# EasyEDA Pro project 2024-SS-ZT-2(最后一练).eprj

# Schematic SCH

## Sheets
1 P1: Create Date: 2024-05-28; Page Name: P1; Project Name: 2024-SS-ZT-2(最后一练); Schematic Name: SCH; Update Date: 2024-05-28; Company: 嘉立创EDA; Page Size: A4; Version: V1.0
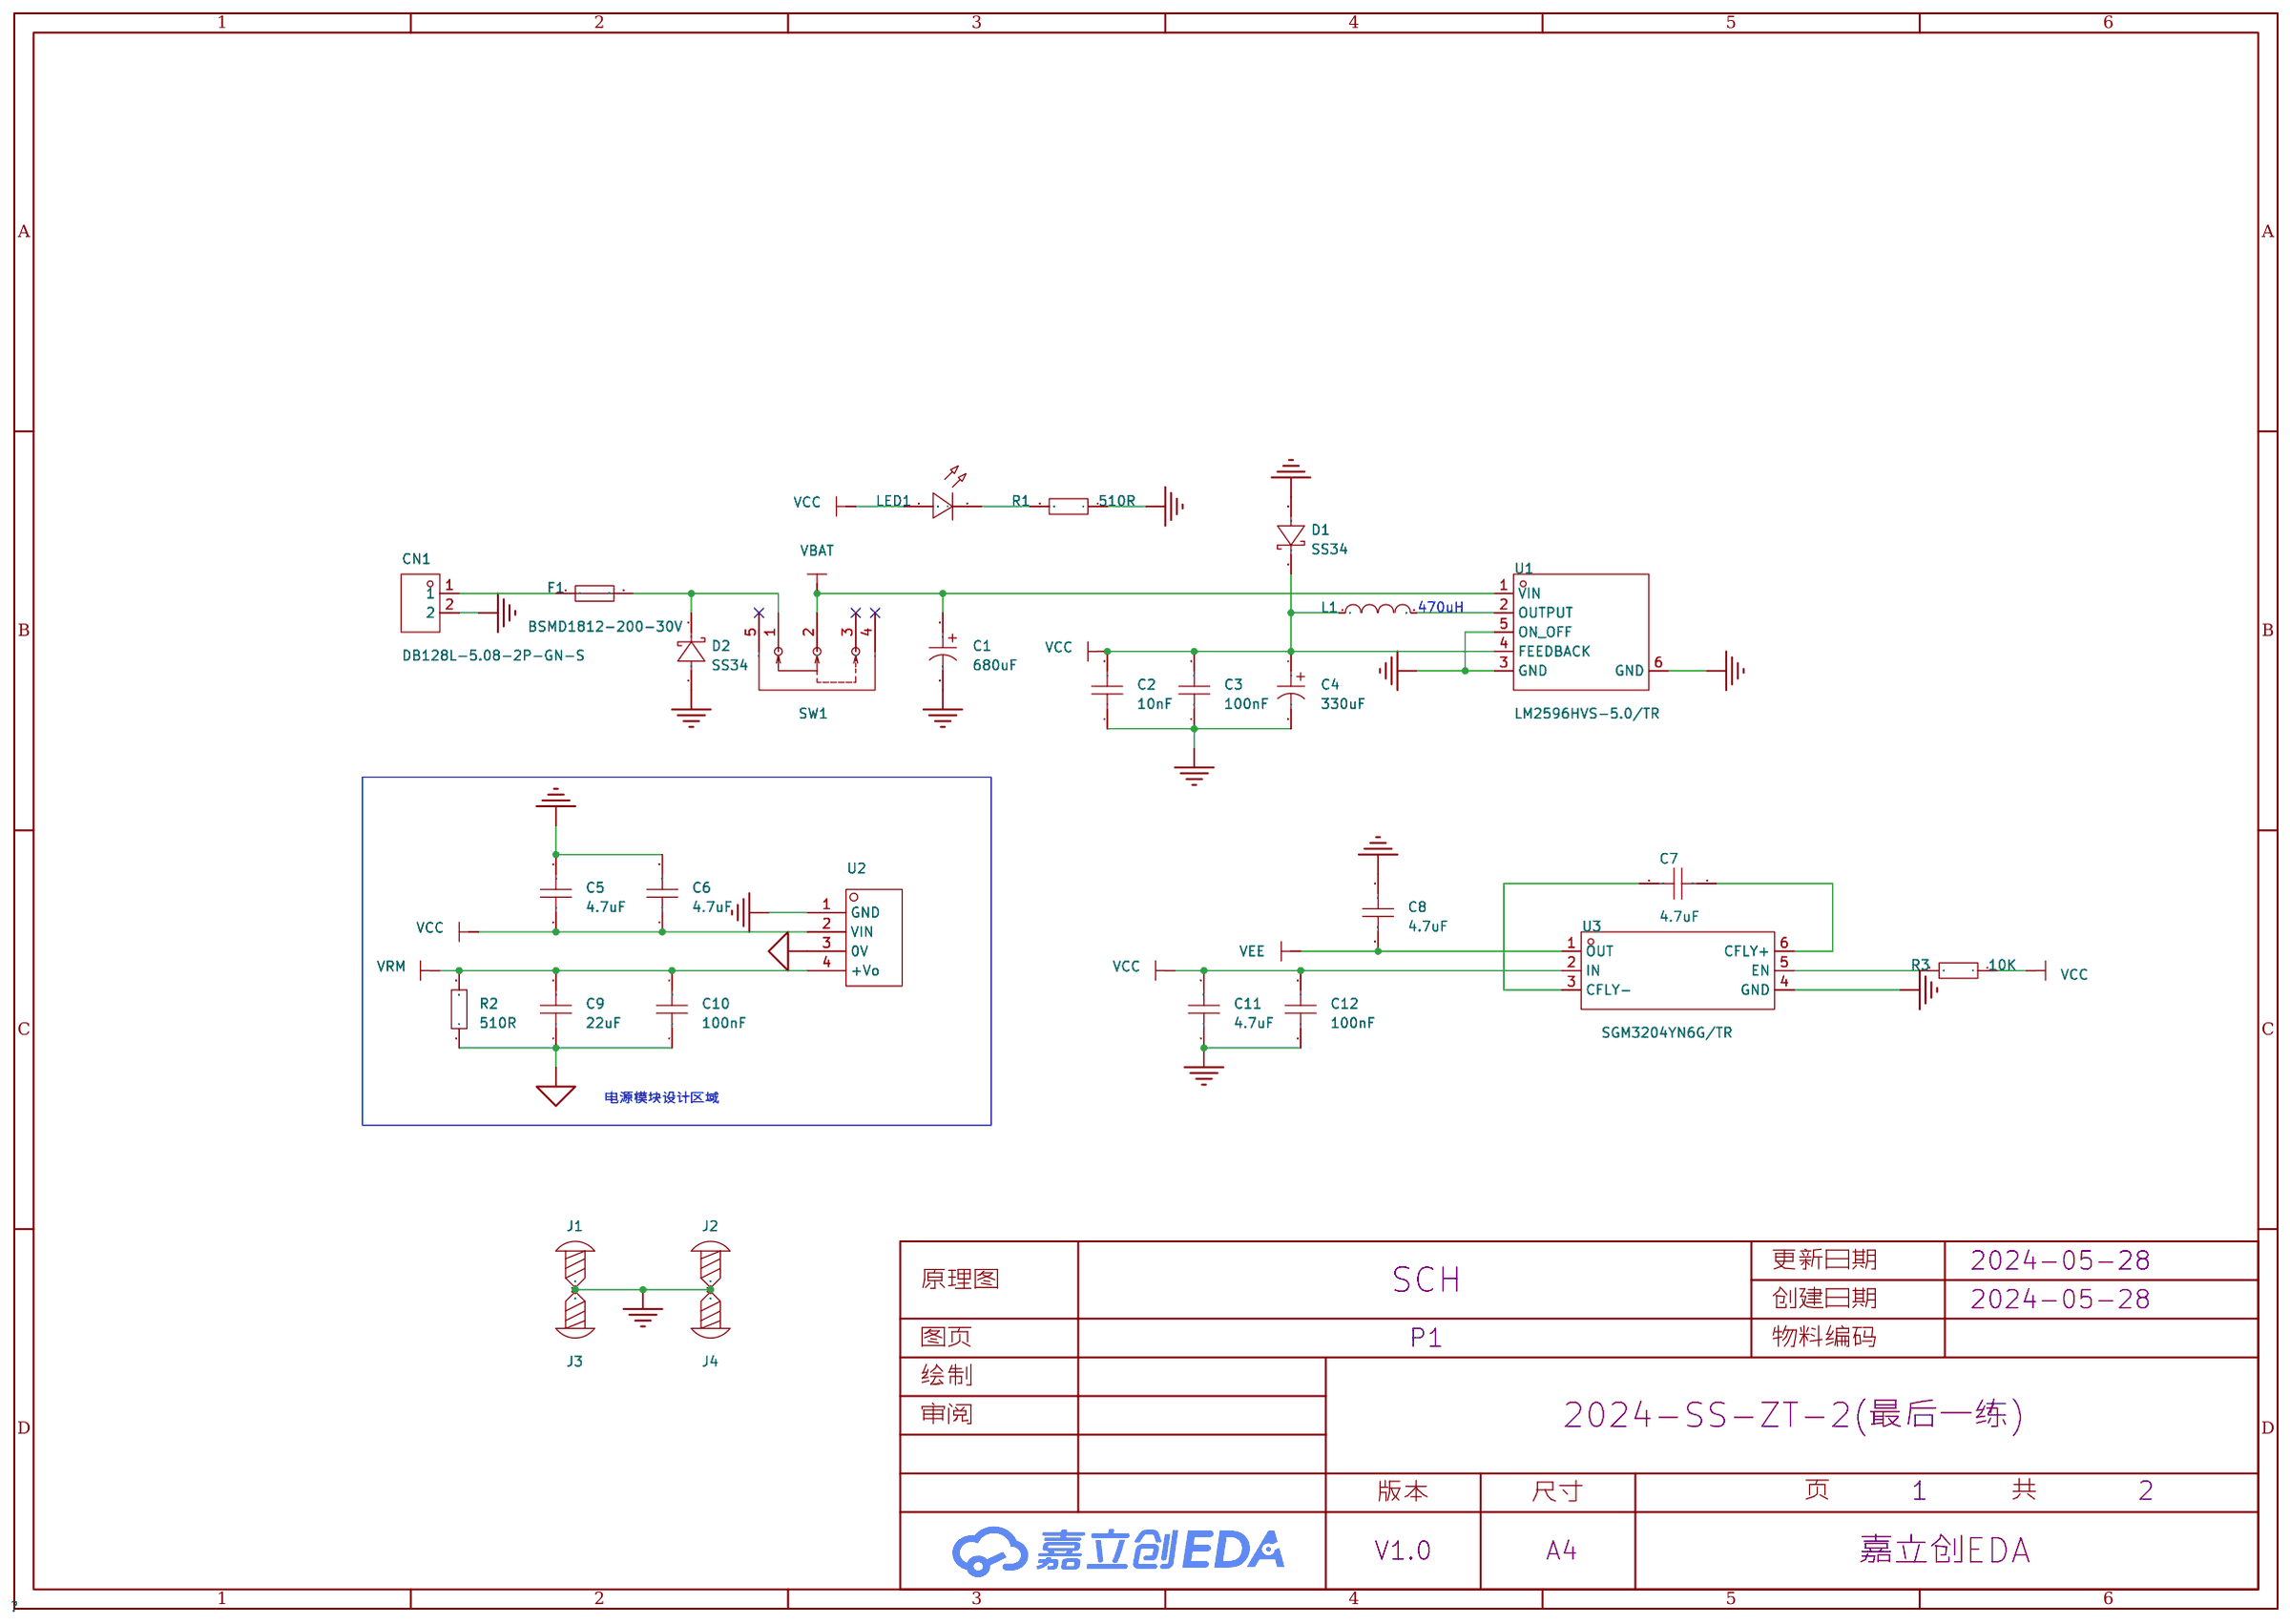
[diagram p0: P1]
2 P2: Page Name: P2; Company: EDA设计与开发
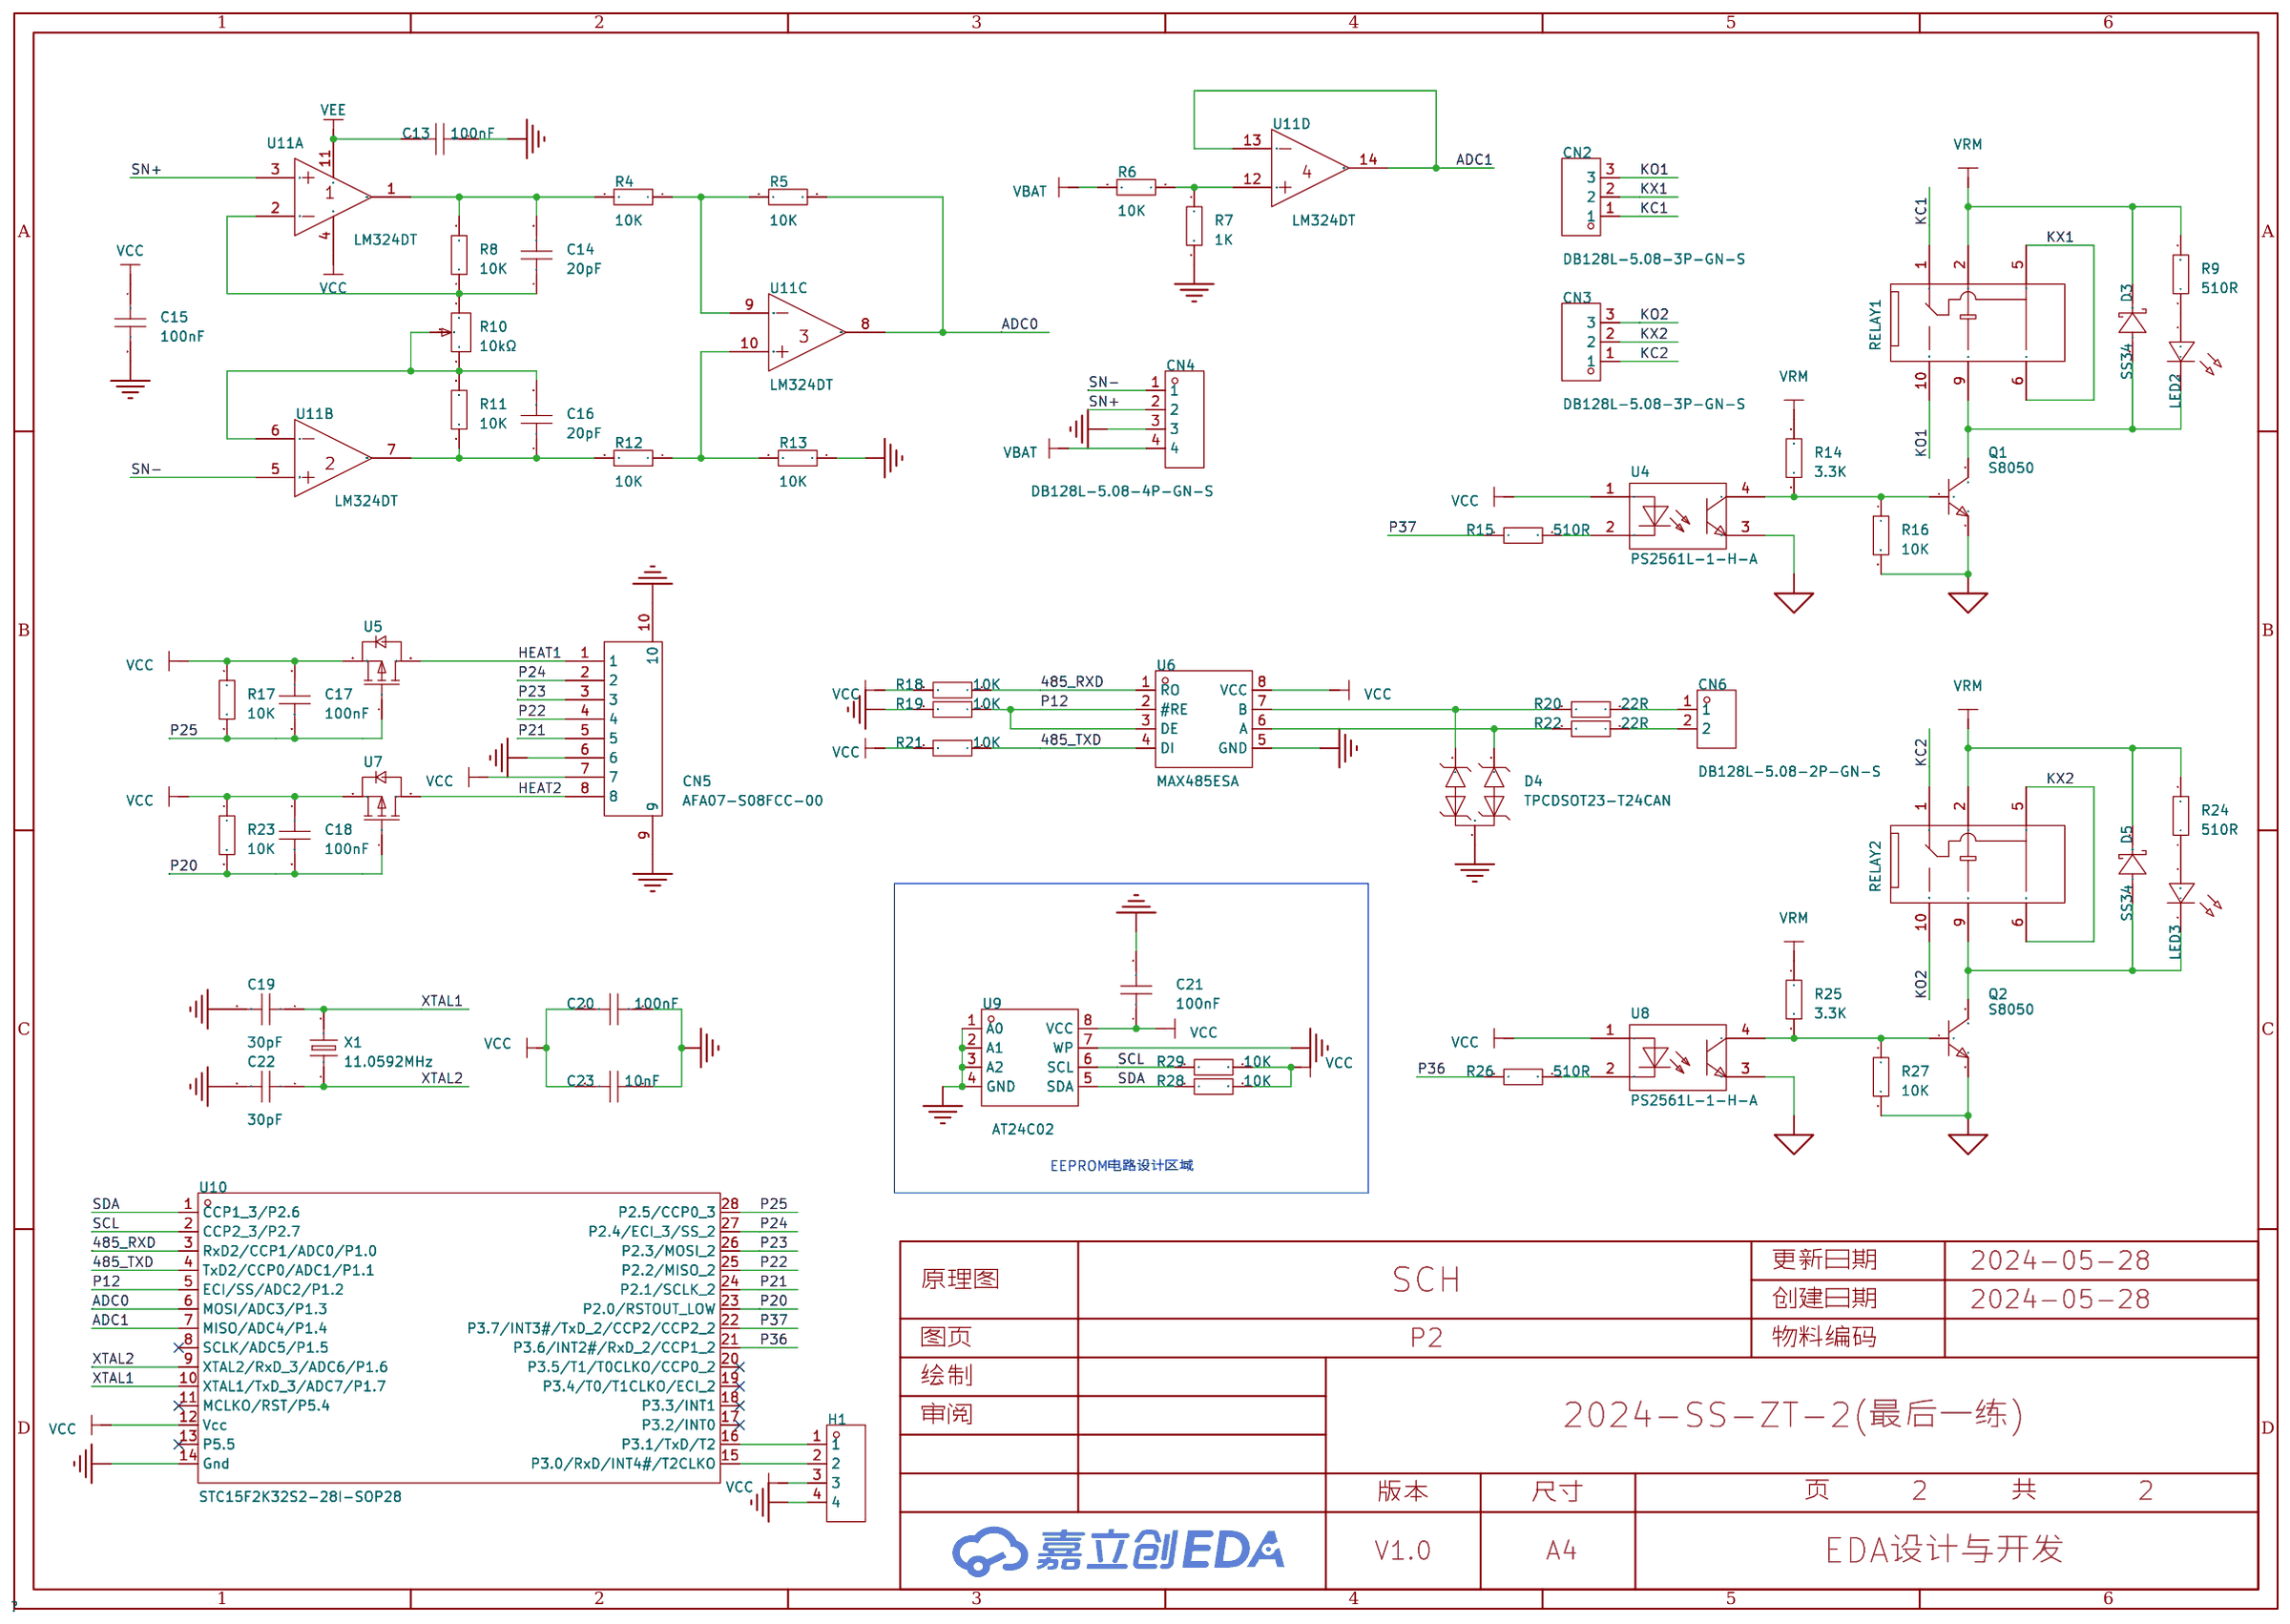
[diagram p1: P2]

## Parts
sheet P1
C1  680uF  [CAP-SMD_BD10.0-L10.3-W10.3-LS11.3-FD]
C2  10nF  [C0805]
C3  100nF  [C0805]
C4  330uF  [CAP-SMD_BD6.3-L6.6-W6.6-LS7.6-RD]
C5  4.7uF  [C1206]
C6  4.7uF  [C1206]
C7  4.7uF  [C1206]
C8  4.7uF  [C1206]
C9  22uF  [C1206]
C10  100nF  [C0805]
C11  4.7uF  [C1206]
C12  100nF  [C0805]
CN1  DB128L-5.08-2P-GN-S  [CONN-TH_2P-P5.08_DB128L-5.08-2P]
D1  SS34  [SMA_L4.3-W2.5-LS5.0-RD]
D2  SS34  [SMA_L4.3-W2.5-LS5.0-RD]
F1  BSMD1812-200-30V  [F1812]
J1  -  [M2螺丝]
J2  -  [M2螺丝]
J3  -  [M2螺丝]
J4  -  [M2螺丝]
L1  470uH  [IND-SMD_L12.0-W12.0_YPRH120X]
LED1  -  [LED_TH-3mm]
R1  510R  [R0805]
R2  510R  [R0805]
R3  10K  [R0805]
SW1  SK12D07VG4  [SW-TH_SK12D07VG4]
U1  LM2596HVS-5.0/TR  [TO-263-5_L10.2-W8.9-P1.70-LS15.2-BR]
U2  -  [TH_PCON]
U3  SGM3204YN6G/TR  [SOT-23-6_L2.9-W1.6-P0.95-LS2.8-BR]
sheet P2
C13  100nF  [C0805]
C14  20pF  [C0805]
C15  100nF  [C0805]
C16  20pF  [C0805]
C17  100nF  [C0805]
C18  100nF  [C0805]
C19  30pF  [C0805]
C20  100nF  [C0805]
C21  100nF  [C0805]
C22  30pF  [C0805]
C23  10nF  [C0805]
CN2  DB128L-5.08-3P-GN-S  [CONN-TH_DB128L-5.08-3P]
CN3  DB128L-5.08-3P-GN-S  [CONN-TH_DB128L-5.08-3P]
CN4  DB128L-5.08-4P-GN-S  [CONN-TH_4P_DB128L-5.08-4P-GN-S]
CN5  AFA07-S08FCC-00  [FPC-SMD_P1.00-8P_LCS-XJ-H2.5]
CN6  DB128L-5.08-2P-GN-S  [CONN-TH_2P-P5.08_DB128L-5.08-2P]
D3  SS34  [SMA_L4.3-W2.5-LS5.0-RD]
D4  TPCDSOT23-T24CAN  [SOT-23-3_L2.9-W1.3-P1.90-LS2.4-BR]
D5  SS34  [SMA_L4.3-W2.5-LS5.0-RD]
H1  -  [HDR-TH_4P-P2.54-V-F]
LED2  -  [LED_TH-3mm]
LED3  -  [LED_TH-3mm]
Q1  S8050  [SOT-23-3_L2.9-W1.3-P1.90-LS2.4-BR]
Q2  S8050  [SOT-23-3_L2.9-W1.3-P1.90-LS2.4-BR]
R4  10K  [R0805]
R5  10K  [R0805]
R6  10K  [R0805]
R7  1K  [R0805]
R8  10K  [R0805]
R9  510R  [R0805]
R10  10kΩ  [RES-ADJ-TH_3P-L10.0-W10.0-P2.50-BL-BS]
R11  10K  [R0805]
R12  10K  [R0805]
R13  10K  [R0805]
R14  3.3K  [R0805]
R15  510R  [R0805]
R16  10K  [R0805]
R17  10K  [R0805]
R18  10K  [R0805]
R19  10K  [R0805]
R20  22R  [R0805]
R21  10K  [R0805]
R22  22R  [R0805]
R23  10K  [R0805]
R24  510R  [R0805]
R25  3.3K  [R0805]
R26  510R  [R0805]
R27  10K  [R0805]
R28  10K  [R0805]
R29  10K  [R0805]
RELAY1  G5V-1 DC5  [RELAY-TH_G5V-1]
RELAY2  G5V-1 DC5  [RELAY-TH_G5V-1]
U4  PS2561L-1-H-A  [SOP-4_L6.5-W4.6-P2.54-LS9.6-TL]
U5  SI2301-ZE  [SOT-23-3_L2.9-W1.3-P1.90-LS2.4-BR]
U6  MAX485ESA  [SOP-8_L5.0-W4.0-P1.27-LS6.0-BL]
U7  SI2301-ZE  [SOT-23-3_L2.9-W1.3-P1.90-LS2.4-BR]
U8  PS2561L-1-H-A  [SOP-4_L6.5-W4.6-P2.54-LS9.6-TL]
U9  AT24C02  [SOP-8_L4.9-W3.9-P1.27-LS6.0-BL]
U10  STC15F2K32S2-28I-SOP28  [SOP-28_L17.9-W7.5-P1.27-LS10.3-BL]
U11  LM324DT  [SOIC-14_L8.7-W3.9-P1.27-LS6.0-BL]  (sections 1,2,3,4)
X1  11.0592MHz  [HC-49US_L11.5-W4.5-P4.88]

## Library data of the parts
C1 = 126RV0105: 容值:680uF;精度:±20%;额定电压:35V;纹波电流:380mA;; LCSC Part Name: 680uF ±20% 35V; Supplier Part: C7461236; Manufacturer: KNSCHA(科尼盛); Supplier Footprint: SMD,D10xL10.5mm; JLCPCB Part Class: Extended Part; Datasheet: https://atta.szlcsc.com/upload/public/pdf/source/20230711/6451BDCB5B323B6F7EF00B061BF0BEEC.pdf; Supplier: LCSC; Tolerance: ±20%; Rated Voltage: 35V; Ripple Current: 380mA; φD: 10mm; L: 10.5mm; Lifetime @ Temp: 2000hrs@105℃; Operating Temperature: -55℃~+105℃
C2 C3 C10 C12-C23 = CAP_0805: Supplier Footprint: 0805
C4 = 126RV0107: 容值:330uF;精度:±20%;额定电压:16V;纹波电流:170mA;; LCSC Part Name: 330uF ±20% 16V; Supplier Part: C7461238; Manufacturer: KNSCHA(科尼盛); Supplier Footprint: SMD,D6.3xL7.7mm; JLCPCB Part Class: Extended Part; Datasheet: https://atta.szlcsc.com/upload/public/pdf/source/20230711/6451BDCB5B323B6F7EF00B061BF0BEEC.pdf; Supplier: LCSC; Tolerance: ±20%; Rated Voltage: 16V; Ripple Current: 170mA; φD: 6.3mm; L: 7.7mm; Lifetime @ Temp: 2000hrs@105℃; Operating Temperature: -55℃~+105℃
C5-C9 C11 = CL31A226KOHNNNE: 容值:22uF;精度:±10%;额定电压:16V;材质(温度系数):X5R;; LCSC Part Name: 22uF ±10% 16V; Supplier Part: C90146; Manufacturer: SAMSUNG(三星); Supplier Footprint: 1206; JLCPCB Part Class: 扩展库; Datasheet: https://atta.szlcsc.com/upload/public/pdf/source/20161228/1482890861309.pdf; Supplier: LCSC; Tolerance: ±10%; Voltage Rated: 16V; Temperature Coefficient: X5R
CN1 CN6 = DB128L-5.08-2P-GN-S: 结构:1x2P;间距:5.08mm;颜色:绿色;安装方式:直插;额定电流:18A;额定电压:250V;排数:1;线规 - AWG:12~30;线规 - 平方毫米:2.5;每排PIN数:2;工作温度范围:-40℃~+105℃;; LCSC Part Name: 5.08mm 1x2P 排数:1 每排P数:2 直插; Supplier Part: C395868; Manufacturer: DORABO(地博电气); Supplier Footprint: 插件,P=5.08mm; JLCPCB Part Class: 扩展库; Datasheet: https://atta.szlcsc.com/upload/public/pdf/source/20230106/B067FE0E641A396A370D47F93C345689.pdf; Supplier: LCSC; Structure: 1x2P; Pitch: 5.08mm; Color: 绿色; Mounting Style: 直插; Current Rating (Max): 18A; Voltage Rating (Max): 250V; Number of Pins: 2P; Number of Rows: 1; Wire Gauge - AWG: 12~30; Wire Gauge - mm2: 2.5; Number of PINs Per Row: 2; Operating Temperature Range: -40℃~+105℃
D1-D3 D5 = SS34_C727060: 二极管配置:独立式;正向压降(Vf):550mV@3A;直流反向耐压(Vr):40V;平均整流电流(Io):3A;; LCSC Part Name: 电压:40V 电流:3A; Supplier Part: C727060; Manufacturer: TWGMC(台湾迪嘉); Supplier Footprint: SMA(DO-214AC); JLCPCB Part Class: 扩展库; Datasheet: https://atta.szlcsc.com/upload/public/pdf/source/20200828/C727059_6599B6CAC5F3238B9C33E46794659DBE.pdf; Supplier: LCSC; Diode Configuration: 独立式; Forward Voltage (Vf@If): 550mV@3A; Reverse Voltage (Vr): 40V; Average Rectified Current (Io): 3A; Reverse Leakage Current (Ir): 500uA@40V
F1 = BSMD1812-200-30V: 最大电压:30V;最大电流:40A;保持电流:2A;跳闸电流:4A;; LCSC Part Name: 30V 2A 1812自恢复; Supplier Part: C960026; Manufacturer: BHFUSE(佰宏); Supplier Footprint: 1812; JLCPCB Part Class: 扩展库; Datasheet: https://atta.szlcsc.com/upload/public/pdf/source/20230512/6ED7FF50F668B3AF958C55F12246A840.pdf; Supplier: LCSC; Operating Voltage (Max): 30V; Current Rating (Max): 40A; Hold Current: 2A; Trip Current: 4A; Power Dissipation: 1W; Resistance - Initial (Ri) (Min): 20mΩ; Resistance - Post Trip (R1) (Max): 100mΩ; Maximum Time to Trip: 2s; Operating Temperature: -40℃~+85℃
J1-J4 = M2螺丝: Supplier Footprint: 插件
L1 = YPRH1209-471M: 电感值:470uH;精度:±20%;额定电流:1.06A;; LCSC Part Name: 470uH ±20%; Supplier Part: C718309; Manufacturer: YJYCOIN(益嘉源); Supplier Footprint: SMD,12x12mm; JLCPCB Part Class: 扩展库; Datasheet: https://atta.szlcsc.com/upload/public/pdf/source/20200623/C339955_D39FA66995A9BB8553FDBD7D9E6E5CB5.pdf; Supplier: LCSC; Tolerance: ±20%; Rated Current: 1.06A; DC Resistance (DCR): 471mΩ
LED1 = LED_TH-R_3mm: Supplier Footprint: 插件
R1-R9 R11-R29 = Res_0805: Supplier Footprint: 0805
SW1 = SK12D07VG4: 电路结构:单刀双掷;安装方式:侧插;额定电流(DC):500mA;额定电压(DC):50V;额定电流(AC):-;额定电压(AC):-;机械寿命:5千次;; LCSC Part Name: 3脚2档位 卧插 滑动开关; Supplier Part: C393937; Manufacturer: SHOU HAN(首韩); Supplier Footprint: 插件; JLCPCB Part Class: 扩展库; Datasheet: https://atta.szlcsc.com/upload/public/pdf/source/20190521/C393937_939FE26E571CC67D2D532E953108A1B0.pdf; Supplier: LCSC; Circuit: 单刀双掷; Actuator Style: 矩形柱状; Pin Style: PC引脚; Switch Height: 8.8mm; Mounting Style: 侧插; Current Rating (DC): 500mA; Voltage Rating (DC): 50V; Mechanical Life: 5千次
U1 = LM2596HVS-5.0/TR: Supplier Part: C7421039; Manufacturer: HGSEMI(华冠); Supplier Footprint: TO-263-5; Datasheet: https://atta.szlcsc.com/upload/public/pdf/source/20230608/50F81A07F1CB4120FC66F79925E72406.pdf; Supplier: LCSC
U2 = PCON
U3 = SGM3204YN6G/TR: 功能类型:-;输入电压:1.4V~5.5V;输出电压:-5.5V~-1.4V;输出电流(最大值):200mA;; Supplier Part: C194031; Manufacturer: SGMICRO(圣邦微); Supplier Footprint: SOT-23-6; JLCPCB Part Class: 扩展库; Datasheet: https://atta.szlcsc.com/upload/public/pdf/source/20180627/C194031_755051E53122D645C36CF727711B963E.pdf; Supplier: LCSC; Input Voltage: 1.4V~5.5V; Output Voltage: -5.5V~-1.4V; Output Current (Max): 200mA; Switching Frequency: 950kHz; Number of Outputs: 1; Switch tube (built-in/external): 内置
CN2 CN3 = DB128L-5.08-3P-GN-S: 结构:1x3P;间距:5.08mm;颜色:绿色;安装方式:直插;额定电流:18A;额定电压:250V;排数:1;线规 - AWG:12~30;线规 - 平方毫米:2.5;每排PIN数:3;工作温度范围:-40℃~+105℃;; LCSC Part Name: 5.08mm 1x3P 排数:1 每排P数:3 直插; Supplier Part: C395869; Manufacturer: DORABO(地博电气); Supplier Footprint: 插件,P=5.08mm; JLCPCB Part Class: 扩展库; Datasheet: https://atta.szlcsc.com/upload/public/pdf/source/20230106/B067FE0E641A396A370D47F93C345689.pdf; Supplier: LCSC; Structure: 1x3P; Pitch: 5.08mm; Color: 绿色; Mounting Style: 直插; Current Rating (Max): 18A; Voltage Rating (Max): 250V; Number of Pins: 3P; Number of Rows: 1; Wire Gauge - AWG: 12~30; Wire Gauge - mm2: 2.5; Number of PINs Per Row: 3; Operating Temperature Range: -40℃~+105℃
CN4 = DB128L-5.08-4P-GN-S: 结构:1x4P;间距:5.08mm;颜色:绿色;安装方式:直插;额定电流:18A;额定电压:250V;排数:1;线规 - AWG:12~30;线规 - 平方毫米:2.5;每排PIN数:4;工作温度范围:-40℃~+105℃;; LCSC Part Name: 5.08mm 1x4P 排数:1 每排P数:4 直插; Supplier Part: C2827883; Manufacturer: DORABO(地博电气); Supplier Footprint: 插件,P=5.08mm; JLCPCB Part Class: 扩展库; Datasheet: https://atta.szlcsc.com/upload/public/pdf/source/20230106/B067FE0E641A396A370D47F93C345689.pdf; Supplier: LCSC; Structure: 1x4P; Pitch: 5.08mm; Color: 绿色; Mounting Style: 直插; Current Rating (Max): 18A; Voltage Rating (Max): 250V; Number of Pins: 4P; Number of Rows: 1; Wire Gauge - AWG: 12~30; Wire Gauge - mm2: 2.5; Number of PINs Per Row: 4; Operating Temperature Range: -40℃~+105℃
CN5 = AFA07-S08FCC-00: 锁定特性:抽屉式;触点类型:下接;触点数量:8P;间距:1mm;安装类型:卧贴;; LCSC Part Name: 间距:1mm P数:8P 抽屉式 下接; Supplier Part: C262342; Manufacturer: JS(钜硕电子); Supplier Footprint: SMD,P=1mm,卧贴; JLCPCB Part Class: 扩展库; Datasheet: https://atta.szlcsc.com/upload/public/pdf/source/20191217/C262716_30B15E9A77BFCA4A54741C92DB3BE8CC.pdf; Supplier: LCSC; Locking Feature: 抽屉式; Contact Type: 下接; Number of Contacts: 8P; Pitch: 1mm; Mounting Type: 卧贴; FFC, FCB Thickness: 0.3mm; Height Above Board: 2.5mm
D4 = TPCDSOT23-T24CAN: Supplier Part: C970033; Manufacturer: TECH PUBLIC(台舟); Supplier Footprint: SOT-23; JLCPCB Part Class: 扩展库; Datasheet: https://atta.szlcsc.com/upload/public/pdf/source/20230522/C1F3B36253468277A14BE124FFAB154C.pdf; Supplier: LCSC
H1 = HDR-F_2.54_1x4P: Supplier Part: C2718488; Supplier Footprint: 插件
LED2 LED3 = LED_TH-G_3mm: Supplier Footprint: 插件
Q1 Q2 = S8050_C2891804: 晶体管类型:NPN;集电极电流(Ic):500mA;集射极击穿电压(Vceo):25V;功率(Pd):300mW;; LCSC Part Name: NPN 电流:500mA 耐压:25V; Supplier Part: C2891804; Manufacturer: YONGYUTAI(永裕泰); Supplier Footprint: SOT-23; JLCPCB Part Class: Extended Part; Datasheet: https://atta.szlcsc.com/upload/public/pdf/source/20210901/5347316A10609C628D4D69AE01446E5B.pdf; Supplier: LCSC; Transistor Type: NPN; Collector Current (Ic): 500mA; Collector-Emitter Breakdown Voltage (Vceo): 25V; Power Dissipation (Pd): 300mW; Collector Cut-Off Current (Icbo): 1uA; Collector-Emitter Saturation Voltage (VCE(sat)@Ic,Ib): 500mV@500mA,50mA
R10 = 3296W-1-203LF: 阻值:20kΩ;精度:±10%;功率:500mW;温度系数:±100ppm/℃;; LCSC Part Name: 20kΩ ±10%; Supplier Part: C34845; Manufacturer: BOURNS; Supplier Footprint: 插件; JLCPCB Part Class: 扩展库; Datasheet: https://atta.szlcsc.com/upload/public/pdf/source/20151026/1457707506403.pdf; Supplier: LCSC; Tolerance: ±10%; Power(Watts): 500mW; Temperature Coefficient: ±100ppm/℃; Turns: 25
RELAY1 RELAY2 = G5V-1 DC5: 线圈电压:5V;触点形式:一组转换:1C(单刀双掷-转换);触点容量(电阻负载):-;最大切换电压:125V@AC；60V@DC;最大切换电流:1A;; LCSC Part Name: 继电器G5V-1-5VDC; Supplier Part: C28695; Manufacturer: OMRON(欧姆龙); Supplier Footprint: DIP,7.5x12.5mm; JLCPCB Part Class: 扩展库; Supplier: LCSC; Coil Voltage: 5V; Contact Form: 一组转换:1C(单刀双掷-转换); Maximum Switching Voltage: 125V@AC；60V@DC; Contact Material: 银+镀金; Maximum Switching Current: 1A; Operate Time: 5ms; Release Time: 5ms; Operating Temperature: -40℃~+70℃
U4 U8 = PS2561L-1-H-A: Supplier Part: C145672; Manufacturer: California Eastern Laboratories; Supplier Footprint: SOP-4-2.54mm; JLCPCB Part Class: 扩展库; Datasheet: https://atta.szlcsc.com/upload/public/pdf/source/20180125/C145673_15168615431091301608.pdf; Supplier: LCSC
U5 U7 = SI2301-ZE: 类型:P沟道;漏源电压(Vdss):20V;连续漏极电流(Id):2.3A;功率(Pd):700mW;导通电阻(RDS(on)@Vgs,Id):126mΩ@4.5V;阈值电压(Vgs(th)@Id):1V@250uA;; LCSC Part Name: P沟道 耐压:20V 电流:2.3A; Supplier Part: C5261052; Manufacturer: HXY MOSFET(华轩阳电子); Supplier Footprint: SOT-23; JLCPCB Part Class: 扩展库; Datasheet: https://atta.szlcsc.com/upload/public/pdf/source/20230515/2FF2907841563ED329594D3237822724.pdf; Supplier: LCSC; Type: P沟道; Drain Source Voltage (Vdss): 20V; Continuous Drain Current (Id): 2.3A; Power Dissipation (Pd): 700mW; Drain Source On Resistance (RDS(on)@Vgs,Id): 126mΩ@4.5V; Gate Threshold Voltage (Vgs(th)@Id): 1V@250uA; Input Capacitance (Ciss@Vds): 285pF
U6 = MAX485ESA_C668206: Supplier Part: C668206; Manufacturer: UMW(友台半导体); Supplier Footprint: SOP-8; JLCPCB Part Class: 扩展库; Datasheet: https://atta.szlcsc.com/upload/public/pdf/source/20231109/489730AE87B90C4B6B8CE65C07B1054C.pdf; Supplier: LCSC
U9 = AT24C02_C7470930: 接口类型:I2C;存储容量:2Kbit;时钟频率(fc):400kHz~1MHz;; LCSC Part Name: AT24C02  2Kbit 12C; Supplier Part: C7470930; Manufacturer: HXY MOSFET(华轩阳电子); Supplier Footprint: SOP-8; JLCPCB Part Class: 扩展库; Datasheet: https://atta.szlcsc.com/upload/public/pdf/source/20230913/748AF0FF0068DF582FAC58AD968E8A28.pdf; Supplier: LCSC; Interface Type: I2C; Memory Size: 2Kbit; Clock Frequency (fc): 400kHz~1MHz; Supply Voltage: 1.8V~5.5V; Data Retention - TDR (Year): 100年
U10 = STC15F2K32S2-28I-SOP28: LCSC Part Name: STC15F2K32S2-28I- SOP28; Supplier Part: C194605; Manufacturer: STC(宏晶); Supplier Footprint: SOP-28-300mil; JLCPCB Part Class: 扩展库; Datasheet: https://atta.szlcsc.com/upload/public/pdf/source/20180730/C194606_29BB2C4DE21484D9E9511E7CB40FB26F.pdf; Supplier: LCSC
U11 = LM324DT: 放大器数:四路;增益带宽积(GBP):1.3MHz;输入偏置电流(Ib):20nA;压摆率(SR):0.4V/us;带宽(-3db):-;; Supplier Part: C71035; Manufacturer: ST(意法半导体); Supplier Footprint: SOIC-14; JLCPCB Part Class: 基础库; Datasheet: https://atta.szlcsc.com/upload/public/pdf/source/20160408/1460100649718.pdf; Supplier: LCSC; Number of Circuits: 四路; Gain Bandwidth Product(GBP): 1.3MHz; Current - Input Bias(Ib): 20nA; Slew Rate(SR): 0.4V/us; Output Current: 40mA; Supply Current: 1.5mA; Operating Temperature: 0℃~+70℃
X1 = TAXD11.0592M2GLFBET2T: 晶振类型:直插晶振;频率:11.0592MHz;常温频差:±30ppm;外接负载电容:20pF;频率稳定度(全温):±30ppm;; LCSC Part Name: 11.0592MHz ±30ppm 20pF; Supplier Part: C127675; Manufacturer: YJX(雅晶鑫); Supplier Footprint: HC-49S; JLCPCB Part Class: 扩展库; Datasheet: https://atta.szlcsc.com/upload/public/pdf/source/20170914/C127676_1505359415156967690.pdf; Supplier: LCSC; Crystal Type: 直插晶振; Normal temperature Frequency Tolerance: ±30ppm; External load capacitor: 20pF; Frequency Stability(Full temperature range): ±30ppm; Equivalent Series Resistance (ESR): 50Ω; Operating Temperature: -20℃~+70℃

## Nets
GND: C1.2 C2.1 C3.1 C4.2 C5.2 C6.2 C8.1 C11.1 C12.1 C13.1 C15.2 C19.2 C20.1 C21.2 C22.2 C23.1 CN1.2 CN4.3 CN5.6 CN5.9 CN5.10 D1.2(A) D2.2(A) D4.3 H1.4 J1.1 J2.1 J3.1 J4.1 R1.1 R7.2 R13.1 R19.2 U1.3(GND) U1.5(ON_OFF) U1.6(GND) U2.1(GND) U3.4(GND) U6.5(GND) U9.1(A0) U9.2(A1) U9.3(A2) U9.4(GND) U9.7(WP) U10.14(Gnd)
VBAT: C1.1 CN4.4 R6.2 SW1.2 U1.1(VIN)
VCC: C2.2 C3.2 C4.1 C5.1 C6.1 C11.2 C12.2 C15.1 C17.1 C18.1 C20.2 C21.1 C23.2 CN5.7 D1.1(C) H1.3 L1.1 LED1.1(C) R3.1 R17.1 R18.2 R21.2 R23.1 R28.2 R29.2 U1.4(FEEDBACK) U2.2(VIN) U3.2(IN) U4.1 U5.2(S) U6.8(VCC) U7.2(S) U8.1 U9.8(VCC) U10.12(Vcc) U11.4(VCC+)
VEE: C8.2 C13.2 U3.1(OUT) U11.11(VCC-)
0: C9.1 C10.1 Q1.2(E) Q2.2(E) R2.1 R16.2 R27.2 U2.3(0V) U4.3 U8.3
485_RXD: R18.1 U6.1(RO) U10.3(RxD2/CCP1/ADC0/P1.0)
485_TXD: R21.1 U6.4(DI) U10.4(TxD2/CCP0/ADC1/P1.1)
ADC0: R5.1 U10.6(MOSI/ADC3/P1.3) U11.8(OUT3)
ADC1: U10.7(MISO/ADC4/P1.4) U11.13(IN4-) U11.14(OUT4)
HEAT1: CN5.1 U5.3(D)
HEAT2: CN5.8 U7.3(D)
KC1: CN2.1 RELAY1.1
KC2: CN3.1 RELAY2.1
KO1: CN2.3 RELAY1.10
KO2: CN3.3 RELAY2.10
KX1: CN2.2 RELAY1.5 RELAY1.6
KX2: CN3.2 RELAY2.5 RELAY2.6
P12: R19.1 U6.2(#RE) U6.3(DE) U10.5(ECI/SS/ADC2/P1.2)
P20: C18.2 R23.2 U7.1(G) U10.23(P2.0/RSTOUT_LOW)
P21: CN5.5 U10.24(P2.1/SCLK_2)
P22: CN5.4 U10.25(P2.2/MISO_2)
P23: CN5.3 U10.26(P2.3/MOSI_2)
P24: CN5.2 U10.27(P2.4/ECI_3/SS_2)
P25: C17.2 R17.2 U5.1(G) U10.28(P2.5/CCP0_3)
P36: R26.1 U10.21(P3.6/INT2#/RxD_2/CCP1_2)
P37: R15.1 U10.22(P3.7/INT3#/TxD_2/CCP2/CCP2_2)
SCL: R29.1 U9.6(SCL) U10.2(CCP2_3/P2.7)
SDA: R28.1 U9.5(SDA) U10.1(CCP1_3/P2.6)
SN+: CN4.2 U11.3(IN1+)
SN-: CN4.1 U11.5(IN2+)
VRM: C9.2 C10.2 D3.1(C) D5.1(C) R2.2 R9.2 R14.1 R24.2 R25.1 RELAY1.2 RELAY2.2 U2.4(+Vo)
XTAL1: C19.1 U10.10(XTAL1/TxD_3/ADC7/P1.7) X1.2
XTAL2: C22.1 U10.9(XTAL2/RxD_3/ADC6/P1.6) X1.1
$1N5406: CN1.1 F1.1
$1N6010: L1.2 U1.2(OUTPUT)
$1N7874: R3.2 U3.5(EN)
$1N8048: C7.2 U3.6(CFLY+)
$1N8053: C7.1 U3.3(CFLY-)
$1N8284: LED1.2(A) R1.2
$1N8627: D2.1(C) F1.2 SW1.1
$2N2031: C16.1 R11.1 R12.2 U11.7(OUT2)
$2N2092: R12.1 R13.2 U11.10(IN3+)
$2N2099: R4.1 R5.2 U11.9(IN3-)
$2N2266: C14.1 R8.1 R10.1 U11.2(IN1-)
$2N2273: C14.2 R4.2 R8.2 U11.1(OUT1)
$2N2314: C16.2 R10.2 R10.3 R11.2 U11.6(IN2-)
$2N3023: CN6.1 R20.1
$2N3053: CN6.2 R22.1
$2N3244: D4.1 R22.2 U6.6(A)
$2N3251: D4.2 R20.2 U6.7(B)
$2N3377: R15.2 U4.2
$2N3466: Q1.1(B) R14.2 R16.1 U4.4
$2N4164: R26.2 U8.2
$2N4168: Q2.1(B) R25.2 R27.1 U8.4
$2N4738: LED2.1(C) R9.1
$2N4742: D3.2(A) LED2.2(A) Q1.3(C) RELAY1.9
$2N4893: LED3.1(C) R24.1
$2N4914: D5.2(A) LED3.2(A) Q2.3(C) RELAY2.9
$2N5025: R6.1 R7.1 U11.12(IN4+)
$2N7138: H1.1 U10.16(P3.1/TxD/T2)
$2N7141: H1.2 U10.15(P3.0/RxD/INT4#/T2CLKO)

Not connected (* = marked no-connect by the designer): SW1 3* 4* 5*; U10 8(SCLK/ADC5/P1.5)* 11(MCLKO/RST/P5.4)* 13(P5.5)* 17(P3.2/INT0)* 18(P3.3/INT1)* 19(P3.4/T0/T1CLKO/ECI_2)* 20(P3.5/T1/T0CLKO/CCP0_2)*

## Notes on the sheets
sheet 1
- 电源模块设计区域
sheet 2
- EEPROM电路设计区域

# Board PCB
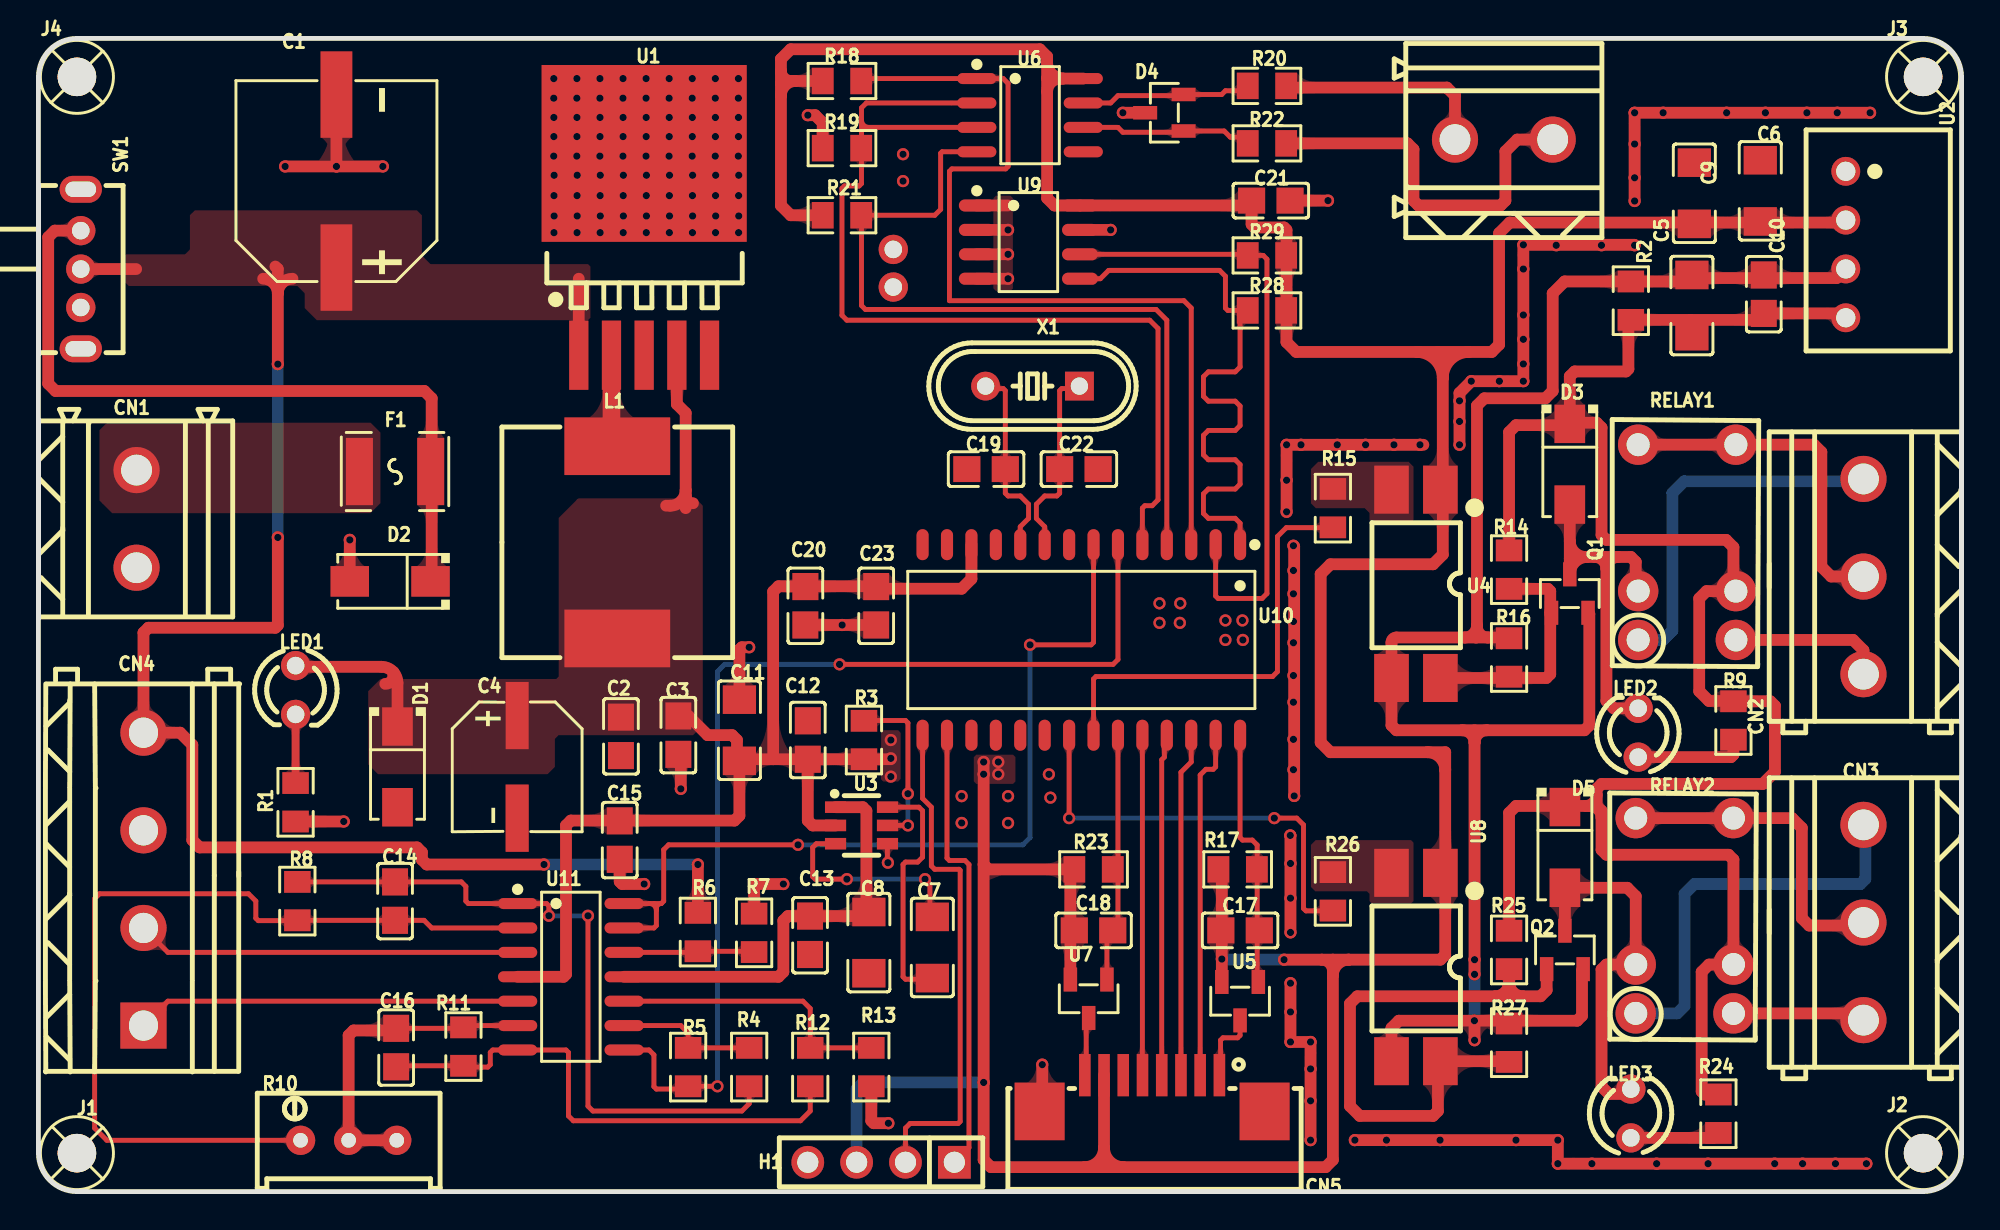
[diagram p2: board, top side]
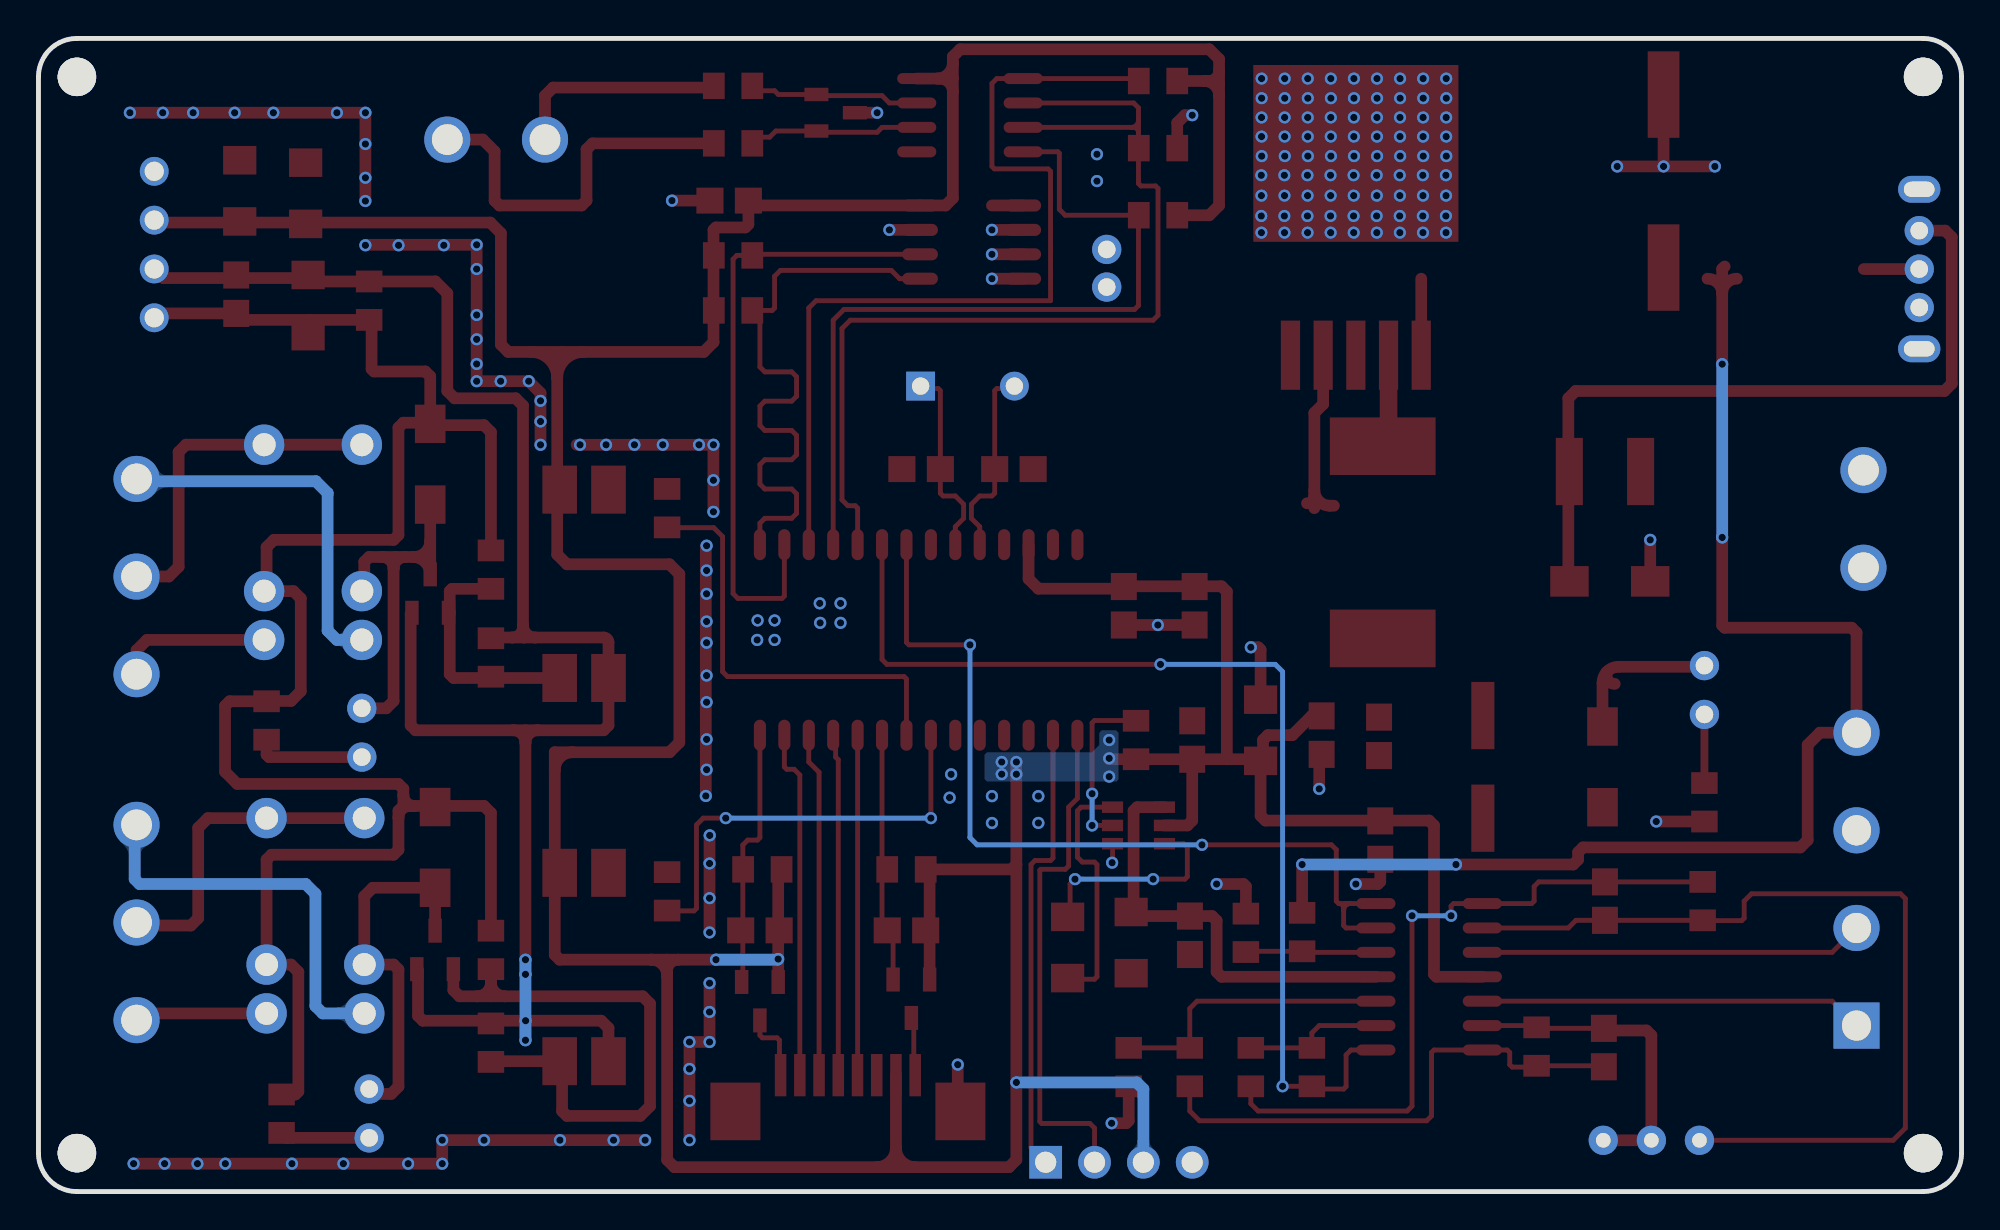
[diagram p3: board, bottom side, seen from below]

Outline 100 x 60 mm; copper layers: Top Layer, Bottom Layer. Coordinates in mm from the lower left corner of the outline.
Outline path: 0,58 0,2 arc(0.59,0.59) 2,0 98,0 arc(99.41,0.59) 100,2 100,58 arc(99.41,59.41) 98,60 2,60 arc(0.59,59.41) 0,58
Stack: Top Layer 0.035mm / Dielectric1 1.51mm FR4 er 4.5 / Bottom Layer 0.035mm

## Design rules (mm)
net SN+: DP1
net SN-: DP1
net SDA: DP3
net SCL: DP3
net XTAL2: DP2
net XTAL1: DP2
template: 自定义配置
spacing copperThickness1oz (default): track to track 0.203, other pairs 0.178 to 0.203
spacing copperThickness2oz: track to track 0.203, other pairs 0.152 to 0.3
track width copperThickness1oz (default): min 0.254, default 0.254, max 2.54
track width copperThickness2oz: min 0.203, default 0.254, max 2.54
track width PWR: min 0.254, default 0.61, max 2.54
differential pair differentialPair (default): width min 0.127, default 0.254, max 2.54; gap min 0.152, default 0.152
via viaSize (default): diameter min 0.635, default 0.635, max 10; hole min 0.381, default 0.381, max 6.299
net 0 uses PWR
net GND uses PWR
net VCC uses PWR
net VRM uses PWR
net VEE uses PWR

## Placement (name value [footprint] x y rotation side)
C1  680uF  [CAP-SMD_BD10.0-L10.3-W10.3-LS11.3-FD]  15.49 52.58 90 top
C2  10nF  [C0805]  30.29 23.69 90 top
C3  100nF  [C0805]  33.27 23.75 90 top
C4  330uF  [CAP-SMD_BD6.3-L6.6-W6.6-LS7.6-RD]  24.89 22.1 270 top
C5  4.7uF  [C1206]  86.11 51.94 90 top
C6  4.7uF  [C1206]  89.53 52.07 90 top
C7  4.7uF  [C1206]  46.48 12.7 270 top
C8  4.7uF  [C1206]  43.18 12.95 90 top
C9  22uF  [C1206]  85.98 46.1 270 top
C10  100nF  [C0805]  89.72 46.69 270 top
C11  4.7uF  [C1206]  36.45 24 270 top
C12  100nF  [C0805]  40 23.5 270 top
C13  100nF  [C0805]  40.12 13.33 90 top
C14  20pF  [C0805]  18.54 15.11 90 top
C15  100nF  [C0805]  30.23 18.29 270 top
C16  20pF  [C0805]  18.6 7.49 90 top
C17  100nF  [C0805]  62.48 13.59 0 top
C18  100nF  [C0805]  54.86 13.59 0 top
C19  30pF  [C0805]  49.28 37.59 180 top
C20  100nF  [C0805]  39.88 30.48 90 top
C21  100nF  [C0805]  64.08 51.56 0 top
C22  30pF  [C0805]  54.1 37.59 0 top
C23  10nF  [C0805]  43.56 30.48 90 top
CN1  DB128L-5.08-2P-GN-S  [CONN-TH_2P-P5.08_DB128L-5.08-2P]  5.1 35 270 top
CN2  DB128L-5.08-3P-GN-S  [CONN-TH_DB128L-5.08-3P]  94.9 32 90 top
CN3  DB128L-5.08-3P-GN-S  [CONN-TH_DB128L-5.08-3P]  94.9 14 90 top
CN4  DB128L-5.08-4P-GN-S  [CONN-TH_4P_DB128L-5.08-4P-GN-S]  5.46 16.26 270 top
CN5  AFA07-S08FCC-00  [FPC-SMD_P1.00-8P_LCS-XJ-H2.5]  57.91 5.11 180 top
CN6  DB128L-5.08-2P-GN-S  [CONN-TH_2P-P5.08_DB128L-5.08-2P]  76.2 54.74 0 top
D1  SS34  [SMA_L4.3-W2.5-LS5.0-RD]  18.67 22.1 270 top
D2  SS34  [SMA_L4.3-W2.5-LS5.0-RD]  18.29 31.75 180 top
D3  SS34  [SMA_L4.3-W2.5-LS5.0-RD]  79.63 37.85 270 top
D4  TPCDSOT23-T24CAN  [SOT-23-3_L2.9-W1.3-P1.90-LS2.4-BR]  58.55 56.13 0 top
D5  SS34  [SMA_L4.3-W2.5-LS5.0-RD]  79.38 17.91 270 top
F1  BSMD1812-200-30V  [F1812]  18.54 37.47 0 top
H1  -  [HDR-TH_4P-P2.54-V-F]  43.81 1.52 180 top
J1  -  [M2螺丝]  2 2 0 top
J2  -  [M2螺丝]  98 2 0 top
J3  -  [M2螺丝]  98 58 0 top
J4  -  [M2螺丝]  2 58 0 top
L1  470uH  [IND-SMD_L12.0-W12.0_YPRH120X]  30.1 33.78 90 top
LED1  -  [LED_TH-3mm]  13.37 26.1 270 top
LED2  -  [LED_TH-3mm]  83.19 23.88 90 top
LED3  -  [LED_TH-3mm]  82.8 4.06 90 top
NOREF  -  [Pad_e4363]  44.45 49.02 0 top
NOREF#2  -  [Pad_e4364]  44.45 47.06 0 top
Q1  S8050  [SOT-23-3_L2.9-W1.3-P1.90-LS2.4-BR]  79.63 31.11 270 top
Q2  S8050  [SOT-23-3_L2.9-W1.3-P1.90-LS2.4-BR]  79.38 12.57 270 top
R1  510R  [R0805]  13.37 20.25 90 top
R2  510R  [R0805]  82.8 46.36 270 top
R3  10K  [R0805]  42.93 23.5 90 top
R4  10K  [R0805]  36.96 6.48 270 top
R5  10K  [R0805]  33.78 6.48 90 top
R6  10K  [R0805]  34.29 13.5 90 top
R7  1K  [R0805]  37.21 13.46 90 top
R8  10K  [R0805]  13.46 15.11 90 top
R9  510R  [R0805]  88.14 24.51 90 top
R10  10kΩ  [RES-ADJ-TH_3P-L10.0-W10.0-P2.50-BL-BS]  16.13 2.67 90 top
R11  10K  [R0805]  22.1 7.54 90 top
R12  10K  [R0805]  40.13 6.48 270 top
R13  10K  [R0805]  43.31 6.48 90 top
R14  3.3K  [R0805]  76.47 32.36 270 top
R15  510R  [R0805]  67.31 35.56 90 top
R16  10K  [R0805]  76.47 27.79 90 top
R17  10K  [R0805]  62.36 16.76 0 top
R18  10K  [R0805]  41.78 57.78 180 top
R19  10K  [R0805]  41.78 54.29 180 top
R20  22R  [R0805]  63.88 57.53 180 top
R21  10K  [R0805]  41.78 50.8 180 top
R22  22R  [R0805]  63.88 54.54 180 top
R23  10K  [R0805]  54.86 16.76 0 top
R24  510R  [R0805]  87.36 4.05 90 top
R25  3.3K  [R0805]  76.47 12.57 270 top
R26  510R  [R0805]  67.31 15.62 90 top
R27  10K  [R0805]  76.47 7.75 90 top
R28  10K  [R0805]  63.88 45.85 0 top
R29  10K  [R0805]  63.88 48.71 0 top
RELAY1  G5V-1 DC5  [RELAY-TH_G5V-1]  85.72 33.78 90 top
RELAY2  G5V-1 DC5  [RELAY-TH_G5V-1]  85.6 14.35 90 top
SW1  SK12D07VG4  [SW-TH_SK12D07VG4]  2.2 48 270 top
U1  LM2596HVS-5.0/TR  [TO-263-5_L10.2-W8.9-P1.70-LS15.2-BR]  31.5 48.77 270 top
U2  -  [TH_PCON]  93.98 53.09 270 top
U3  SGM3204YN6G/TR  [SOT-23-6_L2.9-W1.6-P0.95-LS2.8-BR]  42.8 19.05 180 top
U4  PS2561L-1-H-A  [SOP-4_L6.5-W4.6-P2.54-LS9.6-TL]  71.63 31.62 270 top
U5  SI2301-ZE  [SOT-23-3_L2.9-W1.3-P1.90-LS2.4-BR]  62.48 9.91 90 top
U6  MAX485ESA  [SOP-8_L5.0-W4.0-P1.27-LS6.0-BL]  51.56 56.01 270 top
U7  SI2301-ZE  [SOT-23-3_L2.9-W1.3-P1.90-LS2.4-BR]  54.61 10.03 90 top
U8  PS2561L-1-H-A  [SOP-4_L6.5-W4.6-P2.54-LS9.6-TL]  71.63 11.68 270 top
U9  AT24C02  [SOP-8_L4.9-W3.9-P1.27-LS6.0-BL]  51.48 49.4 270 top
U10  STC15F2K32S2-28I-SOP28  [SOP-28_L17.9-W7.5-P1.27-LS10.3-BL]  54.23 28.7 180 top
U11  LM324DT  [SOIC-14_L8.7-W3.9-P1.27-LS6.0-BL]  27.69 11.18 270 top
X1  11.0592MHz  [HC-49US_L11.5-W4.5-P4.88]  51.69 41.91 180 top

## Footprints (pads in the part's own frame, mm; a bottom-side part is the same pattern mirrored in y, then rotated)
C0805
  rect 1.41x1.35 smd: 1(-1,0) 2(1,0)
C1206
  rect 1.485x1.728 smd: 1(-1.593,0) 2(1.593,0)
CAP-SMD_BD6.3-L6.6-W6.6-LS7.6-RD
  rect 3.5x1.2 smd: 1(-2.67,0) 2(2.67,0)
CAP-SMD_BD10.0-L10.3-W10.3-LS11.3-FD
  rect 4.5x1.65 smd: 1(-4.5,0) 2(4.5,0)
CONN-TH_2P-P5.08_DB128L-5.08-2P
  round 2.4 hole 1.6: 1(-2.54,0) 2(2.54,0)
CONN-TH_4P_DB128L-5.08-4P-GN-S
  rect 2.4x2.4 hole 1.575x1.5: 1(7.62,0)
  round 2.4 hole 1.575x1.5: 2(2.54,0) 3(-2.54,0) 4(-7.62,0)
CONN-TH_DB128L-5.08-3P
  round 2.4 hole 1.6: 1(-5.08,0) 2(0,0) 3(5.08,0)
F1812
  rect 1.407x3.499 smd: 1(-1.853,0) 2(1.853,0)
FPC-SMD_P1.00-8P_LCS-XJ-H2.5
  rect 0.6x2.2 smd: 1(-3.499,-0.943) 2(-2.499,-0.943) 3(-1.5,-0.943) 4(-0.499,-0.943) 5(0.5,-0.943) 6(1.5,-0.943) 7(2.5,-0.943) 8(3.5,-0.943)
  rect 2.6x3 smd: 9(5.85,0.943) 10(-5.85,0.943)
HC-49US_L11.5-W4.5-P4.88
  rect 1.5x1.5 hole 0.9: 1(-2.44,0)
  round 1.5 hole 0.9: 2(2.44,0)
HDR-TH_4P-P2.54-V-F
  rect 1.7x1.7 hole 1.1: 1(-3.81,0)
  round 1.7 hole 1.1: 2(-1.27,0) 3(1.27,0) 4(3.81,0)
IND-SMD_L12.0-W12.0_YPRH120X
  rect 3x5.5 smd: 1(-5,0) 2(5,0)
LED_TH-3mm
  round 1.524 hole 0.914: 1(-1.27,0) 2(1.27,0)
M2螺丝
  round 2 hole 2: 1(0,0)
Pad_e4363
  round 1.524 hole 0.914: 29(0,0)
Pad_e4364
  round 1.524 hole 0.914: 30(0,0)
R0805
  rect 1.133x1.377 smd: 1(-1,0) 2(1,0)
RELAY-TH_G5V-1
  round 2.1 hole 1.2: 1(-5.08,-2.54) 2(-2.54,-2.54) 5(5.08,-2.54) 6(5.08,2.54) 9(-2.54,2.54) 10(-5.08,2.54)
RES-ADJ-TH_3P-L10.0-W10.0-P2.50-BL-BS
  round 1.524 hole 0.762: 1(0,2.5) 2(0,0) 3(0,-2.5)
SMA_L4.3-W2.5-LS5.0-RD
  rect 2x1.593 smd: 1(-2.1,0) 2(2.1,0)
SOIC-14_L8.7-W3.9-P1.27-LS6.0-BL
  oval 0.574x2.038 smd: 1(-3.81,-2.769) 2(-2.54,-2.769) 3(-1.27,-2.769) 4(0,-2.769) 5(1.27,-2.769) 6(2.54,-2.769) 7(3.81,-2.769) 8(3.81,2.769) 9(2.54,2.769) 10(1.27,2.769) 11(0,2.769) 12(-1.27,2.769) 13(-2.54,2.769) 14(-3.81,2.769)
SOP-4_L6.5-W4.6-P2.54-LS9.6-TL
  rect 2.5x1.8 smd: 1(-4.9,1.27) 2(-4.9,-1.27) 3(4.9,-1.27) 4(4.9,1.27)
SOP-8_L4.9-W3.9-P1.27-LS6.0-BL
  oval 0.63x1.865 smd: 1(-1.905,-2.683) 2(-0.635,-2.683) 3(0.635,-2.683) 4(1.905,-2.683) 5(1.905,2.683) 6(0.635,2.683) 7(-0.635,2.683) 8(-1.905,2.683)
SOP-8_L5.0-W4.0-P1.27-LS6.0-BL
  oval 0.574x2.035 smd: 1(-1.905,-2.768) 2(-0.635,-2.768) 3(0.635,-2.768) 4(1.905,-2.768) 5(1.905,2.768) 6(0.635,2.768) 7(-0.635,2.768) 8(-1.905,2.768)
SOP-28_L17.9-W7.5-P1.27-LS10.3-BL
  oval 0.63x1.615 smd: 1(-8.255,-4.957) 2(-6.985,-4.957) 3(-5.715,-4.957) 4(-4.445,-4.957) 5(-3.175,-4.957) 6(-1.905,-4.957) 7(-0.635,-4.957) 8(0.635,-4.957) 9(1.905,-4.957) 10(3.175,-4.957) 11(4.445,-4.957) 12(5.715,-4.957) 13(6.985,-4.957) 14(8.255,-4.957) 15(8.255,4.957) 16(6.985,4.957) 17(5.715,4.957) 18(4.445,4.957) 19(3.175,4.957) 20(1.905,4.957) 21(0.635,4.957) 22(-0.635,4.957) 23(-1.905,4.957) 24(-3.175,4.957) 25(-4.445,4.957) 26(-5.715,4.957) 27(-6.985,4.957) 28(-8.255,4.957)
SOT-23-3_L2.9-W1.3-P1.90-LS2.4-BR
  rect 1.25x0.7 smd: 1(1,-0.95) 2(1,0.95) 3(-1,0)
SOT-23-6_L2.9-W1.6-P0.95-LS2.8-BR
  rect 1.1x0.6 smd: 1(1.35,-0.95) 2(1.35,0) 3(1.35,0.95) 4(-1.35,0.95) 5(-1.35,0) 6(-1.35,-0.95)
SW-TH_SK12D07VG4
  round 1.524 hole 0.914: 1(-2,0) 2(0,0) 3(2,0)
  oval 1.4x2.2 hole 0.8x1.6: 4(4.15,0) 5(-4.15,0)
TH_PCON
  round 1.5 hole 1: 1(0,0) 2(2.54,0) 3(5.08,0) 4(7.62,0)
TO-263-5_L10.2-W8.9-P1.70-LS15.2-BR
  rect 3.6x1 smd: 1(5.25,-3.4) 2(5.25,-1.7) 3(5.25,0) 4(5.25,1.7) 5(5.25,3.4)
  rect 9.2x10.668 smd: 6(-5.25,0)

## Nets
As in the schematic, except:
GND: C1.2 C2.1 C3.1 C4.2 C5.2 C6.2 C8.1 C11.1 C12.1 C13.1 C15.2 C19.2 C20.1 C21.2 C22.2 C23.1 CN1.2 CN4.3 CN5.6 CN5.9 CN5.10 D1.2 D2.2 D4.3 H1.4 J1.1 J2.1 J3.1 J4.1 NOREF.29 NOREF#2.30 R1.1 R7.2 R13.1 R19.2 U1.3 U1.5 U1.6 U2.1 U3.4 U6.5 U9.1 U9.2 U9.3 U9.4 U9.7 U10.14

Pads without a net: SW1 3 4 5; U10 8 11 13 17 18 19 20

## Via types
v1: diameter 0.635, hole 0.381, Top Layer to Bottom Layer, 213 vias

## Routing (per net, layer and track width the routed paths; a pad name or vN(x,y) marks a point on that pad's centre or on a via; arc(x,y) is an arc through that point)
GND: length 149
  Top Layer w0.254: v1(44.17,17.11) 44.15,17.14 44.15,18.04
  Top Layer w0.61: v1(65.3,20.58) 65.3,33.56 v1(65.26,33.61) ; U9.4 v1(50.42,47.5) ; U9.2 v1(50.42,50.04) ; C1.2 v1(15.49,53.34) ; v1(15.49,53.34) v1(12.83,53.34) ; v1(15.49,53.34) v1(17.91,53.34) ; v1(31.5,16) 30.35,16 30.23,16.13 C15.2 ; R19.2 40.78,55.61 40.39,56.01 v1(40,56.01) ; C20.1 v1(41.79,29.48) C23.1 ; v1(52.2,6.6) 52.2,4.31 CN5.9 ; D2.2 v1(16.19,33.91) ; 72.01,38.86 v1(71.84,38.86) v1(70.49,38.86) v1(69.01,38.86) v1(67.54,38.86) v1(65.65,38.86) v1(64.9,38.86) v1(64.9,37.01) v1(64.9,35.37) ; v1(38.74,16) 37.34,16 37.21,15.88 R7.2 ; U9.1 50.42,51.31 ; v1(83,49.24) 82.97,49.26 v1(77.21,49.26) v1(77.21,48) v1(77.21,45.61) v1(77.21,44.35) v1(77.21,43.06) v1(77.21,42.17) v1(75.97,42.17) v1(74.51,42.17) 73.89,41.55 v1(73.89,41.14) v1(73.89,40.07) v1(73.89,38.86) ; v1(95.05,1.45) v1(93.44,1.45) v1(91.73,1.45) v1(90.28,1.45) v1(86.82,1.45) v1(84.15,1.45) v1(80.78,1.45) v1(79.01,1.45) v1(79.01,2.68) v1(76.83,2.68) v1(72.88,2.68) v1(70.1,2.68) v1(68.45,2.68) ; v1(65.1,13.48) v1(65.1,15.27) v1(65.1,17.07) 65.1,18.52 v1(65.09,18.53) ; D4.3 v1(56.39,56.13) ; C11.1 36.45,28.19 36.58,28.32 v1(36.96,28.32) ; C3.1 33.4,22.62 v1(33.4,20.95) ; v1(95.24,56.13) v1(93.54,56.13) v1(91.96,56.13) v1(89.8,56.13) v1(87.78,56.13) v1(84.48,56.13) v1(83,56.13) v1(83,54.51) v1(83,52.75) v1(83,51.54) ; v1(66.15,2.68) v1(66.15,4.72) v1(66.15,6.38) v1(66.15,7.78) v1(65.1,7.78) v1(65.1,9.35) v1(65.1,10.84) ; R1.1 v1(15.88,19.25) ; C21.2 v1(67.06,51.56) ; U9.3 v1(50.42,48.77) ; U9.7 v1(55.75,50.04) ; v1(44.2,3.56) 43.43,3.56 43.31,3.68 R13.1
  vias: v1(26.8,57.91) v1(26.79,56.89) v1(26.8,55.89) v1(26.8,54.89) v1(26.79,53.88) v1(26.81,52.88) v1(26.81,51.82) v1(26.81,50.76) v1(26.81,49.9) v1(28,57.91) v1(27.99,56.89) v1(28,55.89) v1(28,54.89) v1(27.99,53.88) v1(28.01,52.88) v1(28.01,51.82) v1(28.01,50.76) v1(28.01,49.9) v1(29.2,57.91) v1(29.19,56.89) v1(29.2,55.89) v1(29.2,54.89) v1(29.19,53.88) v1(29.21,52.88) v1(29.21,51.82) v1(29.21,50.76) v1(29.21,49.9) v1(30.4,57.91) v1(30.39,56.89) v1(30.4,55.89) v1(30.4,54.89) v1(30.39,53.88) v1(30.41,52.88) v1(30.41,51.82) v1(30.41,50.76) v1(30.41,49.9) v1(31.6,57.91) v1(31.59,56.89) v1(31.6,55.89) v1(31.6,54.89) v1(31.59,53.88) v1(31.61,52.88) v1(31.61,51.82) v1(31.61,50.76) v1(31.61,49.9) v1(32.8,57.91) v1(32.79,56.89) v1(32.8,55.89) v1(32.8,54.89) v1(32.79,53.88) v1(32.81,52.88) v1(32.81,51.82) v1(32.81,50.76) v1(32.81,49.9) v1(34,57.91) v1(33.99,56.89) v1(34,55.89) v1(34,54.89) v1(33.99,53.88) v1(34.01,52.88) v1(34.01,51.82) v1(34.01,50.76) v1(34.01,49.9) v1(35.2,57.91) v1(35.19,56.89) v1(35.2,55.89) v1(35.2,54.89) v1(35.19,53.88) v1(35.21,52.88) v1(35.21,51.82) v1(35.21,50.76) v1(35.21,49.9) v1(36.4,57.91) v1(36.39,56.89) v1(36.4,55.89) v1(36.4,54.89) v1(36.39,53.88) v1(36.41,52.88) v1(36.41,51.82) v1(36.41,50.76) v1(36.41,49.9) v1(44.96,53.97) v1(44.96,52.58) v1(48.01,20.57) v1(48.01,19.18) v1(50.42,20.57) v1(50.42,19.18) v1(52.54,21.71) v1(52.62,20.5) v1(58.29,30.61) v1(58.29,29.59) v1(59.37,30.61) v1(59.35,29.59) v1(61.72,29.72) v1(61.72,28.7) v1(62.61,29.72) v1(62.63,28.7) v1(65.26,32.32) v1(65.26,31.1) v1(65.26,29.66) v1(65.26,28.56) v1(65.26,26.85) v1(65.26,25.46) v1(65.26,23.53) v1(65.26,21.95) v1(78.92,49.24) v1(81.28,49.24)
VBAT: length 77.9
  Top Layer w0.61: CN4.4 7.37,23.88 8,23.24 8,18.29 8.38,17.91 19.69,17.91 19.94,17.65 19.94,17.27 20.19,17.02 v1(26.29,17.02) ; CN4.4 5.46,23.62 ; CN4.4 5.46,29.08 5.72,29.34 12.32,29.34 12.45,29.46 v1(12.45,34.04) ; 12.45,46.74 v1(12.45,43.05) ; 12.45,46.74 12.45,48.01 12.32,48.13 ; 12.45,46.74 arc(12.22,47.27) 11.68,47.5 ; 12.45,46.74 arc(12.67,47.27) 13.21,47.5 ; SW1.2 5.08,48 ; U1.1 28.1,47.5 ; v1(34.29,17.02) R6.2
  Bottom Layer w0.61: v1(12.45,34.04) v1(12.45,43.05) ; v1(34.29,17.02) v1(26.29,17.02)
VCC: length 324.7
  Top Layer w0.61: C12.2 40,19.3 40.26,19.05 U3.2 ; C12.2 38.2,22.5 ; C12.2 R3.1 44.32,22.5 ; C23.2 43.54,31.5 38.48,31.5 38.2,31.22 38.2,22.5 ; 36.36,22.5 C11.2 36.45,19.56 36.19,19.3 30.21,19.3 ; 36.36,22.5 36.32,22.54 36.32,23.5 36.07,23.75 34.8,23.75 33.8,24.75 C3.2 ; 36.36,22.5 38.2,22.5 ; 33.66,36.49 33.66,36.19 ; 33.66,36.49 33.66,40.51 33.2,40.97 U1.4 ; 33.66,36.49 arc(33.42,35.92) 32.85,35.69 32.64,35.69 ; 33.66,36.19 33.66,35.56 ; 33.66,36.19 arc(33.77,35.93) 34.04,35.81 ; 67.31,11.49 67.31,12.06 ; 67.31,11.49 67.31,11.25 ; 67.31,11.49 arc(67.14,11.9) 66.73,12.06 ; 67.31,12.06 68.13,12.06 ; 67.31,12.06 66.73,12.06 ; 54.76,1.27 54.99,1.27 ; 54.76,1.27 54.4,1.27 ; 54.76,1.27 arc(54.92,1.29) 55.07,1.35 ; 54.99,1.27 56.42,1.27 ; 54.99,1.27 55.07,1.35 ; v1(64.77,12.06) 66.73,12.06 ; 13.37,27.37 13.43,27.31 17.83,27.31 arc(18.18,27.23) 18.46,27.02 ; D1.1 18.67,26.47 arc(18.62,26.76) 18.46,27.02 ; 64.9,45.83 R28.2 ; 64.9,45.83 64.9,44.2 65.41,43.69 71.67,43.69 ; 64.9,45.83 64.9,48.69 R29.2 64.9,48.73 64.9,50.04 64.77,50.17 63.25,50.17 63.08,50.33 C21.1 arc(63.01,51.38) 62.83,51.31 U9.8 52.83,51.31 52.45,51.69 52.45,57.23 ; 67.31,11.25 67.31,1.65 66.93,1.27 56.42,1.27 ; 67.31,11.25 arc(67.55,11.83) 68.13,12.06 ; 49.15,17.02 v1(49.15,5.68) 49.15,1.65 49.53,1.27 54.4,1.27 ; 49.15,17.02 49.4,16.76 R23.1 ; 49.15,17.02 v1(49.15,21.72) v1(49.15,22.35) ; 72.77,43.69 73.03,43.43 73.03,42.33 ; 72.77,43.69 74.38,43.69 ; 72.77,43.69 71.67,43.69 ; 54.4,1.27 arc(55.12,1.56) 55.41,2.28 ; 74.38,43.69 75.57,43.69 75.95,44.07 75.95,49.87 76.5,50.42 89.48,50.42 ; 74.38,43.69 arc(73.42,43.29) 73.03,42.33 ; 38.61,57.03 38.61,51.31 39.12,50.8 R21.2 ; 38.61,57.03 38.61,57.66 ; 38.61,57.03 arc(38.83,57.56) 39.37,57.78 ; 55.41,1.92 55.41,1.69 55.33,1.61 ; 55.41,1.92 55.41,2.28 ; 55.41,1.92 arc(55.39,1.76) 55.33,1.61 ; U7.2 53.66,16.59 ; 73.15,16.33 73.15,12.32 72.9,12.06 68.13,12.06 ; 73.15,16.33 U8.1 ; 73.15,16.33 73.15,21.94 ; 73.03,36.4 73.03,42.33 ; 73.03,36.4 73.03,33.15 72.52,32.64 67.18,32.64 66.68,32.13 66.68,23.37 67.18,22.86 72.23,22.86 ; 73.03,36.4 U4.1 ; 73.03,42.33 arc(72.63,43.29) 71.67,43.69 ; 56.42,1.27 arc(55.7,1.56) 55.41,2.28 ; U2.2 93.85,50.42 89.48,50.42 ; 30.21,19.3 27.69,19.3 27.43,19.05 27.43,11.3 27.31,11.18 U11.4 ; 30.21,19.3 C15.1 ; 68.13,12.06 68.15,12.06 ; 72.23,22.86 73.15,22.86 73.15,21.94 ; 72.23,22.86 arc(72.88,22.59) 73.15,21.94 ; 39.14,57.78 39.37,57.78 ; 39.14,57.78 38.74,57.78 38.61,57.66 ; 39.14,57.78 arc(38.76,57.94) 38.61,58.31 ; 39.37,57.78 R18.2 ; 43.81,31.37 48.01,31.37 48.51,31.88 U10.12 ; 55.41,2.28 CN5.7 ; 38.61,58.31 38.61,58.93 39.12,59.44 52.07,59.44 52.45,59.06 52.45,58.73 ; 38.61,58.31 38.61,57.66 ; 89.48,50.42 C6.1 ; 55.33,1.61 55.07,1.35 ; 55.33,1.61 arc(55.22,1.46) 55.07,1.35 ; 52.45,57.93 52.47,57.91 53.13,57.91 ; 52.45,57.93 52.45,57.23 ; 52.45,57.93 52.45,58.73 ; 18.46,27.02 18.46,26.84 arc(18.34,26.54) 18.03,26.42 ; 53.27,57.91 53.13,57.91 ; 53.27,57.91 U6.8 ; 53.27,57.91 arc(52.69,58.15) 52.45,58.73 ; 53.13,57.91 arc(52.65,57.71) 52.45,57.23 ; U5.2 v1(61.53,12.1) 61.53,16.59 R17.1
  Bottom Layer w0.61: v1(49.15,5.68) 42.89,5.68 42.54,5.33 H1.3 ; v1(61.53,12.1) 61.57,12.06 v1(64.77,12.06)
  vias: v1(44.32,23.5) v1(44.32,22.54) v1(44.32,21.59) v1(49.91,22.35) v1(49.91,21.72)
VEE: length 22.7
  Top Layer w0.61: U3.1 42.87,20 43.05,19.81 43.05,14.67 C8.2 42.97,14.33 C13.2 38.97,14.33 38.74,14.1 38.74,11.43 38.48,11.18 U11.11
0: length 101
  Top Layer w0.61: 85.82,47.53 85.64,47.36 R2.1 79.36,47.36 78.74,46.74 78.74,41.66 78.36,41.28 75.18,41.28 74.8,40.89 74.8,29.46 ; 85.82,47.53 C9.1 ; 85.82,47.53 93.51,47.53 U2.3 ; v1(74.67,8.89) 76.58,8.89 ; v1(74.67,8.89) 74.68,8.88 v1(74.68,7.87) ; v1(74.67,8.89) 70.74,8.89 70.36,8.51 U8.3 ; 76.58,8.89 76.73,8.75 ; 76.58,8.89 80.01,8.89 80.26,9.14 80.26,11.51 80.32,11.57 ; 74.04,24 70.61,24 70.36,24.26 U4.3 70.36,28.58 arc(70.43,28.75) 70.61,28.83 74.17,28.83 ; 74.04,24 75.31,24 ; 74.04,24 arc(74.49,23.82) 74.68,23.37 ; 74.8,29.46 74.8,29.39 ; 74.8,29.46 arc(74.62,29.01) 74.17,28.83 ; 74.8,29.39 74.8,28.88 74.75,28.83 ; 74.8,29.39 arc(74.97,28.99) 75.37,28.83 ; 74.75,28.83 75.37,28.83 ; 74.75,28.83 74.17,28.83 ; 74.68,23.37 v1(74.68,12.06) v1(74.68,11.3) ; 74.68,23.37 74.68,24 ; 74.68,23.37 arc(74.86,23.82) 75.31,24 ; 75.31,24 80.39,24 80.65,24.26 80.65,30.05 80.58,30.11 ; 75.37,28.83 76.69,28.83 arc(76.71,28.82) 76.73,28.79
  Bottom Layer w0.61: v1(74.68,12.06) v1(74.68,11.3) v1(74.68,7.87)
485_RXD: length 47
  Top Layer w0.254: R18.1 42.91,57.91 U6.1 50.16,57.91 50.42,57.66 50.42,53.34 50.29,53.21 47.5,53.21 47.37,53.09 47.37,46.36 59.56,46.36 59.94,45.97 U10.3
485_TXD: length 41.7
  Top Layer w0.254: U6.4 46.99,54.1 46.91,54.03 46.91,51.11 46.61,50.8 R21.1 42.8,50.78 42.8,46.1 43,45.9 58.12,45.9 58.67,45.34 U10.4
ADC0: length 55.4
  Top Layer w0.254: v1(41.66,27.43) 55.88,27.43 56.13,27.69 U10.6 ; v1(35.31,5.48) R5.1 33.64,5.33 32.13,5.33 32,5.46 32,7.11 31.75,7.37 U11.8
  Bottom Layer w0.254: v1(35.31,5.48) 35.31,27.05 35.69,27.43 v1(41.66,27.43)
ADC1: length 46.5
  Top Layer w0.254: 32,14.99 32.13,14.86 32.13,14.73 ; 32,14.99 32.38,14.99 ; 32,14.99 31.77,14.99 ; v1(39.5,18.04) 32.77,18.04 32.51,17.79 32.51,15.11 32.38,14.99 ; 31.77,14.99 U11.14 ; 31.77,14.99 arc(32.03,14.88) 32.13,14.63 ; v1(51.56,28.45) 54.74,28.45 54.86,28.58 U10.7 ; 32.38,14.99 arc(32.21,14.91) 32.13,14.73 ; 32.13,14.73 32.13,14.63 ; 32.13,14.63 32.13,13.84 32,13.72 U11.13
  Bottom Layer w0.254: v1(51.56,28.45) 51.56,18.42 51.19,18.04 v1(39.5,18.04)
HEAT1: length 3.7
  Top Layer w0.254: U5.3 62.48,8.13 62.36,8 61.59,8 61.47,7.87 61.47,6.11 CN5.1
HEAT2: length 3.1
  Top Layer w0.254: 54.74,9.03 54.48,8.78 54.48,6.13 CN5.8
KC1: length 8.2
  Top Layer w0.61: 88.14,28.7 94.36,28.7 94.9,28.16 CN2.1
KC2: length 6.9
  Top Layer w0.61: RELAY2.1 94.55,9.27 CN3.1
KO1: length 19.5
  Bottom Layer w0.61: 83.06,28.7 84.48,28.7 84.96,29.18 84.96,36.35 85.57,36.96 94.78,36.96 CN2.3
KO2: length 21.1
  Bottom Layer w0.61: RELAY2.10 85.22,9.27 85.6,9.65 85.6,15.49 86.11,16 94.74,16 95,16.26 95,18.98 CN3.3
KX1: length 18.2
  Top Layer w0.61: CN2.2 94.9,32 93.22,32 92.71,32.51 92.71,38.48 92.33,38.86 83.06,38.86
KX2: length 17
  Top Layer w0.61: RELAY2.6 RELAY2.5 91.19,19.43 91.69,18.92 91.69,14.22 92.07,13.84 94.74,13.84 CN3.2
P12: length 52.5
  Top Layer w0.254: 43.18,55.37 43.07,55.37 arc(42.88,55.29) 42.8,55.1 ; 43.18,55.37 48.54,55.37 ; 43.18,55.37 arc(42.91,55.48) 42.8,55.75 ; 42.8,55.75 42.8,56.39 43.05,56.64 48.54,56.64 ; 42.8,55.75 42.8,55.1 ; 42.8,55.1 42.8,54.31 R19.1 42.8,54.28 42.8,52.45 42.67,52.32 41.91,52.32 41.78,52.2 41.78,45.59 42.04,45.34 57.78,45.34 58.22,44.91 58.22,35.99 57.91,35.69 57.53,35.69 57.4,35.56 U10.5
P20: length 12.9
  Top Layer w0.254: U7.1 55.56,13.28 C18.2 56.13,13.86 U10.23
P21: length 17.7
  Top Layer w0.254: U10.24 57.4,6.06 CN5.5
P22: length 17.8
  Top Layer w0.254: U10.25 58.55,23.62 58.55,22.61 58.41,22.47 CN5.4
P23: length 17.9
  Top Layer w0.254: CN5.3 59.41,21.82 59.94,22.35 U10.26
P24: length 18.2
  Top Layer w0.254: CN5.2 60.41,21.67 60.71,21.97 61.09,21.97 61.21,22.1 U10.27
P25: length 13.5
  Top Layer w0.254: U10.28 62.48,18.42 62.61,18.29 63.12,18.29 63.37,18.03 63.37,10.97 U5.1
P36: length 22.6
  Top Layer w0.254: U10.21 v1(53.59,19.43) ; R26.1 67.29,14.61 65.91,14.61 65.78,14.73 65.78,19.08 65.43,19.43 v1(64.26,19.43)
  Bottom Layer w0.254: v1(53.59,19.43) v1(64.26,19.43)
P37: length 22.8
  Top Layer w0.254: R15.1 67.29,34.54 64.89,34.54 64.43,34.08 64.43,27.05 64.17,26.8 54.99,26.8 54.86,26.67 U10.22
SCL: length 32.7
  Top Layer w0.254: U10.2 61.21,30.99 61.34,30.86 63.63,30.86 63.88,31.11 63.88,48.51 63.68,48.71 R29.1 62.82,48.77 U9.6
SDA: length 32.7
  Top Layer w0.254: U10.1 62.48,34.78 62.23,35.03 60.83,35.03 60.58,35.28 60.58,36.3 60.83,36.56 62.23,36.56 62.48,36.81 62.48,37.83 62.23,38.08 60.83,38.08 60.58,38.33 60.58,39.35 60.83,39.6 62.23,39.6 62.48,39.86 62.48,40.87 62.23,41.13 60.83,41.13 60.58,41.38 60.58,42.4 60.83,42.65 62.23,42.65 62.48,42.91 62.48,45.45 R28.1 61.85,45.85 61.72,45.97 61.72,47.62 61.42,47.93 55.65,47.93 55.22,47.5 U9.5
SN+: length 20
  Top Layer w0.254: U11.3 6.73,12.45 CN4.2
SN-: length 20
  Top Layer w0.254: CN4.1 6.73,9.91 U11.5
VRM: length 108.3
  Top Layer w0.61: C9.2 85.98,45.28 85.9,45.36 ; 85.9,45.36 89.38,45.36 C10.2 93.75,45.69 U2.4 ; 85.9,45.36 R2.2 82.68,45.23 82.68,42.8 82.55,42.67 79.88,42.67 79.63,42.42 D3.1 79.7,39.88 76.84,39.88 76.47,39.51 R14.1 ; R24.2 86.64,5.05 86.49,5.21 86.49,11.43 86.87,11.81 RELAY2.2 88.14,17.27 87.88,17.53 81.53,17.53 81.28,17.78 81.28,19.46 ; 79.88,40 81.03,40 81.28,39.75 81.28,34.16 81.53,33.91 87.76,33.91 88.14,33.53 88.14,31.24 86.74,31.24 86.36,30.86 86.36,26.03 86.87,25.53 88.12,25.53 R9.2 90.06,25.51 90.3,25.27 90.3,21.84 89.66,21.21 81.28,21.21 81.03,20.95 81.03,20.64 ; 79.32,20.07 79.38,20.01 ; 79.32,20.07 80.45,20.07 ; 79.32,20.07 76.84,20.07 76.47,19.7 R25.1 ; 81.03,20.64 81.03,20.07 ; 81.03,20.64 arc(80.86,20.23) 80.45,20.07 ; 80.68,20.07 81.03,20.07 ; 80.68,20.07 80.45,20.07 ; 80.68,20.07 arc(81.1,19.89) 81.28,19.46 ; 81.03,20.07 81.28,19.81 81.28,19.46
XTAL1: length 10.2
  Top Layer w0.254: X1.2 49.38,41.78 50.16,41.78 50.28,41.67 C19.1 50.28,36.34 50.42,36.19 51.05,36.19 51.49,35.76 51.49,35.03 51.05,34.59 U10.10
XTAL2: length 10.2
  Top Layer w0.254: X1.1 54,41.78 53.21,41.78 53.1,41.67 C22.1 53.1,36.34 52.96,36.19 52.32,36.19 51.89,35.76 51.89,35.03 52.32,34.59 U10.9
$1N6010: length 4.9
  Top Layer w0.914: U1.2 29.8,39.08 L1.2
$1N7874: length 8.7
  Top Layer w0.254: v1(45.21,19.05) U3.5 ; v1(45.21,20.7) 45.21,24.38 45.09,24.51 42.94,24.51 R3.2
  Bottom Layer w0.254: v1(45.21,19.05) v1(45.21,20.7)
$1N8048: length 12.9
  Top Layer w0.254: U3.6 45.79,20 45.97,19.81 45.97,17.4 45.72,17.14 45.09,17.14 44.96,17.02 44.96,11.18 45.09,11.05 46.42,11.05 C7.2
$1N8053: length 10.8
  Top Layer w0.254: v1(46.1,16.26) 46.35,16 46.35,14.42 C7.1 ; U3.3 40.45,18.1 40.26,17.91 40.26,16.38 40.39,16.26 v1(42.04,16.26)
  Bottom Layer w0.254: v1(46.1,16.26) v1(42.04,16.26)
$1N8284: length 3.6
  Top Layer w0.406: R1.2 LED1.2
$1N8627: length 39.3
  Top Layer w0.61: 20.45,37.52 F1.2 ; 20.45,37.52 20.45,31.81 D2.1 ; 20.45,37.52 20.45,41.28 20.07,41.66 0.89,41.66 0.51,42.04 0.51,49.66 0.85,50 SW1.1
$2N2031: length 27.3
  Top Layer w0.254: C16.1 18.65,6.54 R11.1 22.17,6.48 23.37,6.48 23.5,6.6 23.5,7.24 23.62,7.37 U11.7 27.43,7.37 27.56,7.24 27.56,3.94 27.81,3.68 39.62,3.68 40.13,4.19 R12.2
$2N2092: length 15.1
  Top Layer w0.254: R13.2 R12.1 40.13,9.53 39.75,9.91 U11.10
$2N2099: length 7.5
  Top Layer w0.254: U11.9 33.4,8.64 33.78,8.25 33.78,7.74 ; 33.78,7.74 34.04,7.48 R4.1 ; 33.78,7.74 R5.2
$2N2266: length 46.3
  Top Layer w0.254: R10.1 3.56,2.67 2.92,3.3 2.92,15.24 3.17,15.49 10.92,15.49 11.3,15.11 11.3,14.22 11.43,14.1 13.45,14.1 R8.1 C14.1 20.05,14.11 20.45,13.72 U11.2
$2N2273: length 36
  Top Layer w0.254: v1(26.54,14.35) 26.54,14.86 26.42,14.99 U11.1 22.35,14.99 22.22,15.11 22.22,15.88 21.99,16.11 C14.2 R8.2 ; R4.2 36.96,4.57 36.58,4.19 28.83,4.19 28.57,4.44 v1(28.57,14.35)
  Bottom Layer w0.254: v1(28.57,14.35) v1(26.54,14.35)
$2N2314: length 17
  Top Layer w0.254: U11.6 22.19,8.64 R11.2 22.05,8.49 C16.2
  Top Layer w0.61: C16.2 18.49,8.38 16.38,8.38 16.13,8.13 R10.2 R10.3
$2N3023: length 11.1
  Top Layer w0.61: 65.04,57.44 73.24,57.44 73.66,57.02 CN6.1
$2N3053: length 19.7
  Top Layer w0.61: CN6.2 76.89,54.74 76.28,54.12 76.28,51.56 76.03,51.31 71.75,51.31 71.5,51.56 71.5,54.23 71.19,54.54 R22.1
$2N3244: length 9
  Top Layer w0.254: R22.2 62.56,54.86 61.98,54.86 61.66,55.18 D4.1 59.48,55.12 56.39,55.12 56.13,55.37 U6.6
$2N3251: length 8.9
  Top Layer w0.254: U6.7 55.75,56.64 56.13,57.02 59.49,57.02 D4.2 61.53,57.08 61.72,57.28 62.63,57.28 R20.2
$2N3466: length 12.5
  Top Layer w0.61: 76.66,26.72 78.41,26.72 78.61,26.92 78.61,30.05 Q1.1 78.61,30.18 78.61,31.24 78.49,31.36 R14.2 ; 76.66,26.72 U4.4 ; 76.66,26.72 76.73,26.79
$2N4168: length 32
  Top Layer w0.61: 76.73,6.75 76.69,6.78 U8.4 72.77,6.66 72.77,4.19 72.52,3.94 68.71,3.94 68.2,4.44 68.2,9.78 68.58,10.16 75.76,10.16 ; 76.47,10.88 76.47,10.16 ; 76.47,10.88 76.47,11.57 ; 76.47,10.88 arc(76.68,10.37) 77.19,10.16 ; 76.47,10.88 arc(76.26,10.37) 75.76,10.16 ; 75.76,10.16 77.19,10.16 ; 77.19,10.16 78.1,10.16 78.43,10.48 78.43,11.57
$2N4738: length 5.8
  Top Layer w0.61: LED2.1 88.01,22.61 88.14,22.73 R9.1
$2N4742: length 22.7
  Top Layer w0.61: 79.63,32.93 Q1.3 arc(79.89,32.75) 80.53,33.02 ; 79.63,32.93 79.72,33.02 80.46,33.02 ; 79.63,32.93 79.63,33.85 ; 80.93,33.02 80.53,33.02 ; 80.93,33.02 81.42,33.02 ; 80.93,33.02 arc(81.36,32.84) 81.53,32.42 ; 80.53,33.02 80.46,33.02 ; 79.63,33.85 D3.2 ; 79.63,33.85 arc(79.87,33.26) 80.46,33.02 ; 81.42,33.02 82.14,33.02 ; 81.42,33.02 81.53,32.91 81.53,32.42 ; 82.14,33.02 82.8,33.02 83.06,32.77 83.06,31.24 ; 82.14,33.02 arc(81.71,32.84) 81.53,32.42 ; LED2.2 81.91,25.15 81.53,25.53 81.53,32.42
$2N4893: length 4.7
  Top Layer w0.61: R24.1 87.1,2.79 LED3.1
$2N4914: length 19.4
  Top Layer w0.61: LED3.2 82.55,5.08 81.66,5.08 81.28,5.46 81.28,11.56 81.53,11.81 RELAY2.9 83.06,15.37 82.62,15.81 D5.2 Q2.3
$2N5025: length 6.8
  Top Layer w0.254: U11.12 34.23,12.45 R6.1 37.17,12.5 R7.1
$2N7138: length 23.5
  Top Layer w0.254: H1.1 48.39,2.29 48.39,17.02 48.18,17.23 47.37,17.23 47.24,17.35 U10.16
$2N7141: length 26.4
  Top Layer w0.254: H1.2 45.09,3.3 45.33,3.54 47.83,3.54 47.93,3.65 47.93,16.71 47.87,16.77 46.6,16.77 46.43,16.94 46.43,20 45.97,20.46 U10.15

## Copper pours and planes (outline as drawn; the poured copper is in the pictures)
GND on Top Layer: -9.4,68.83 112.27,68.83 112.27,-12.45 -9.4,-12.45
GND on Top Layer: 49.66,51.82 50.67,51.82 50.67,46.86 49.66,46.86
GND on Bottom Layer: -5.97,63.75 108.08,63.75 108.08,-8 -5.97,-8
VBAT on Top Layer: 4.4,51.05 28.7,51.05 28.7,45.34 4.4,45.34
VCC on Top Layer: 43.81,24 44.83,24 44.83,21.34 43.81,21.34
VCC on Top Layer: 17.14,36.07 34.54,36.07 34.54,21.72 17.14,21.72
VCC on Top Layer: 48.64,22.73 50.8,22.73 50.8,21.21 48.64,21.21
VCC on Bottom Layer: 43.84,24 50.8,24 50.8,21.34 43.84,21.34
$1N5406 on Top Layer: 3.17,40 17.78,40 17.78,35.3 3.17,35.3
$2N3377 on Top Layer: 66.17,37.97 71.5,37.97 71.5,34.8 66.17,34.8
$2N4164 on Top Layer: 66.17,18.29 71.5,18.29 71.5,14.99 66.17,14.99

Small or netless copper shapes (teardrops, artwork), in the pictures only: 325 on Top Layer, 17 on Bottom Layer
